# EAGLE schematic AM6548 (EAGLE 9.4.2), part 3 of 4
## Sheet 8 of 19: Debugging
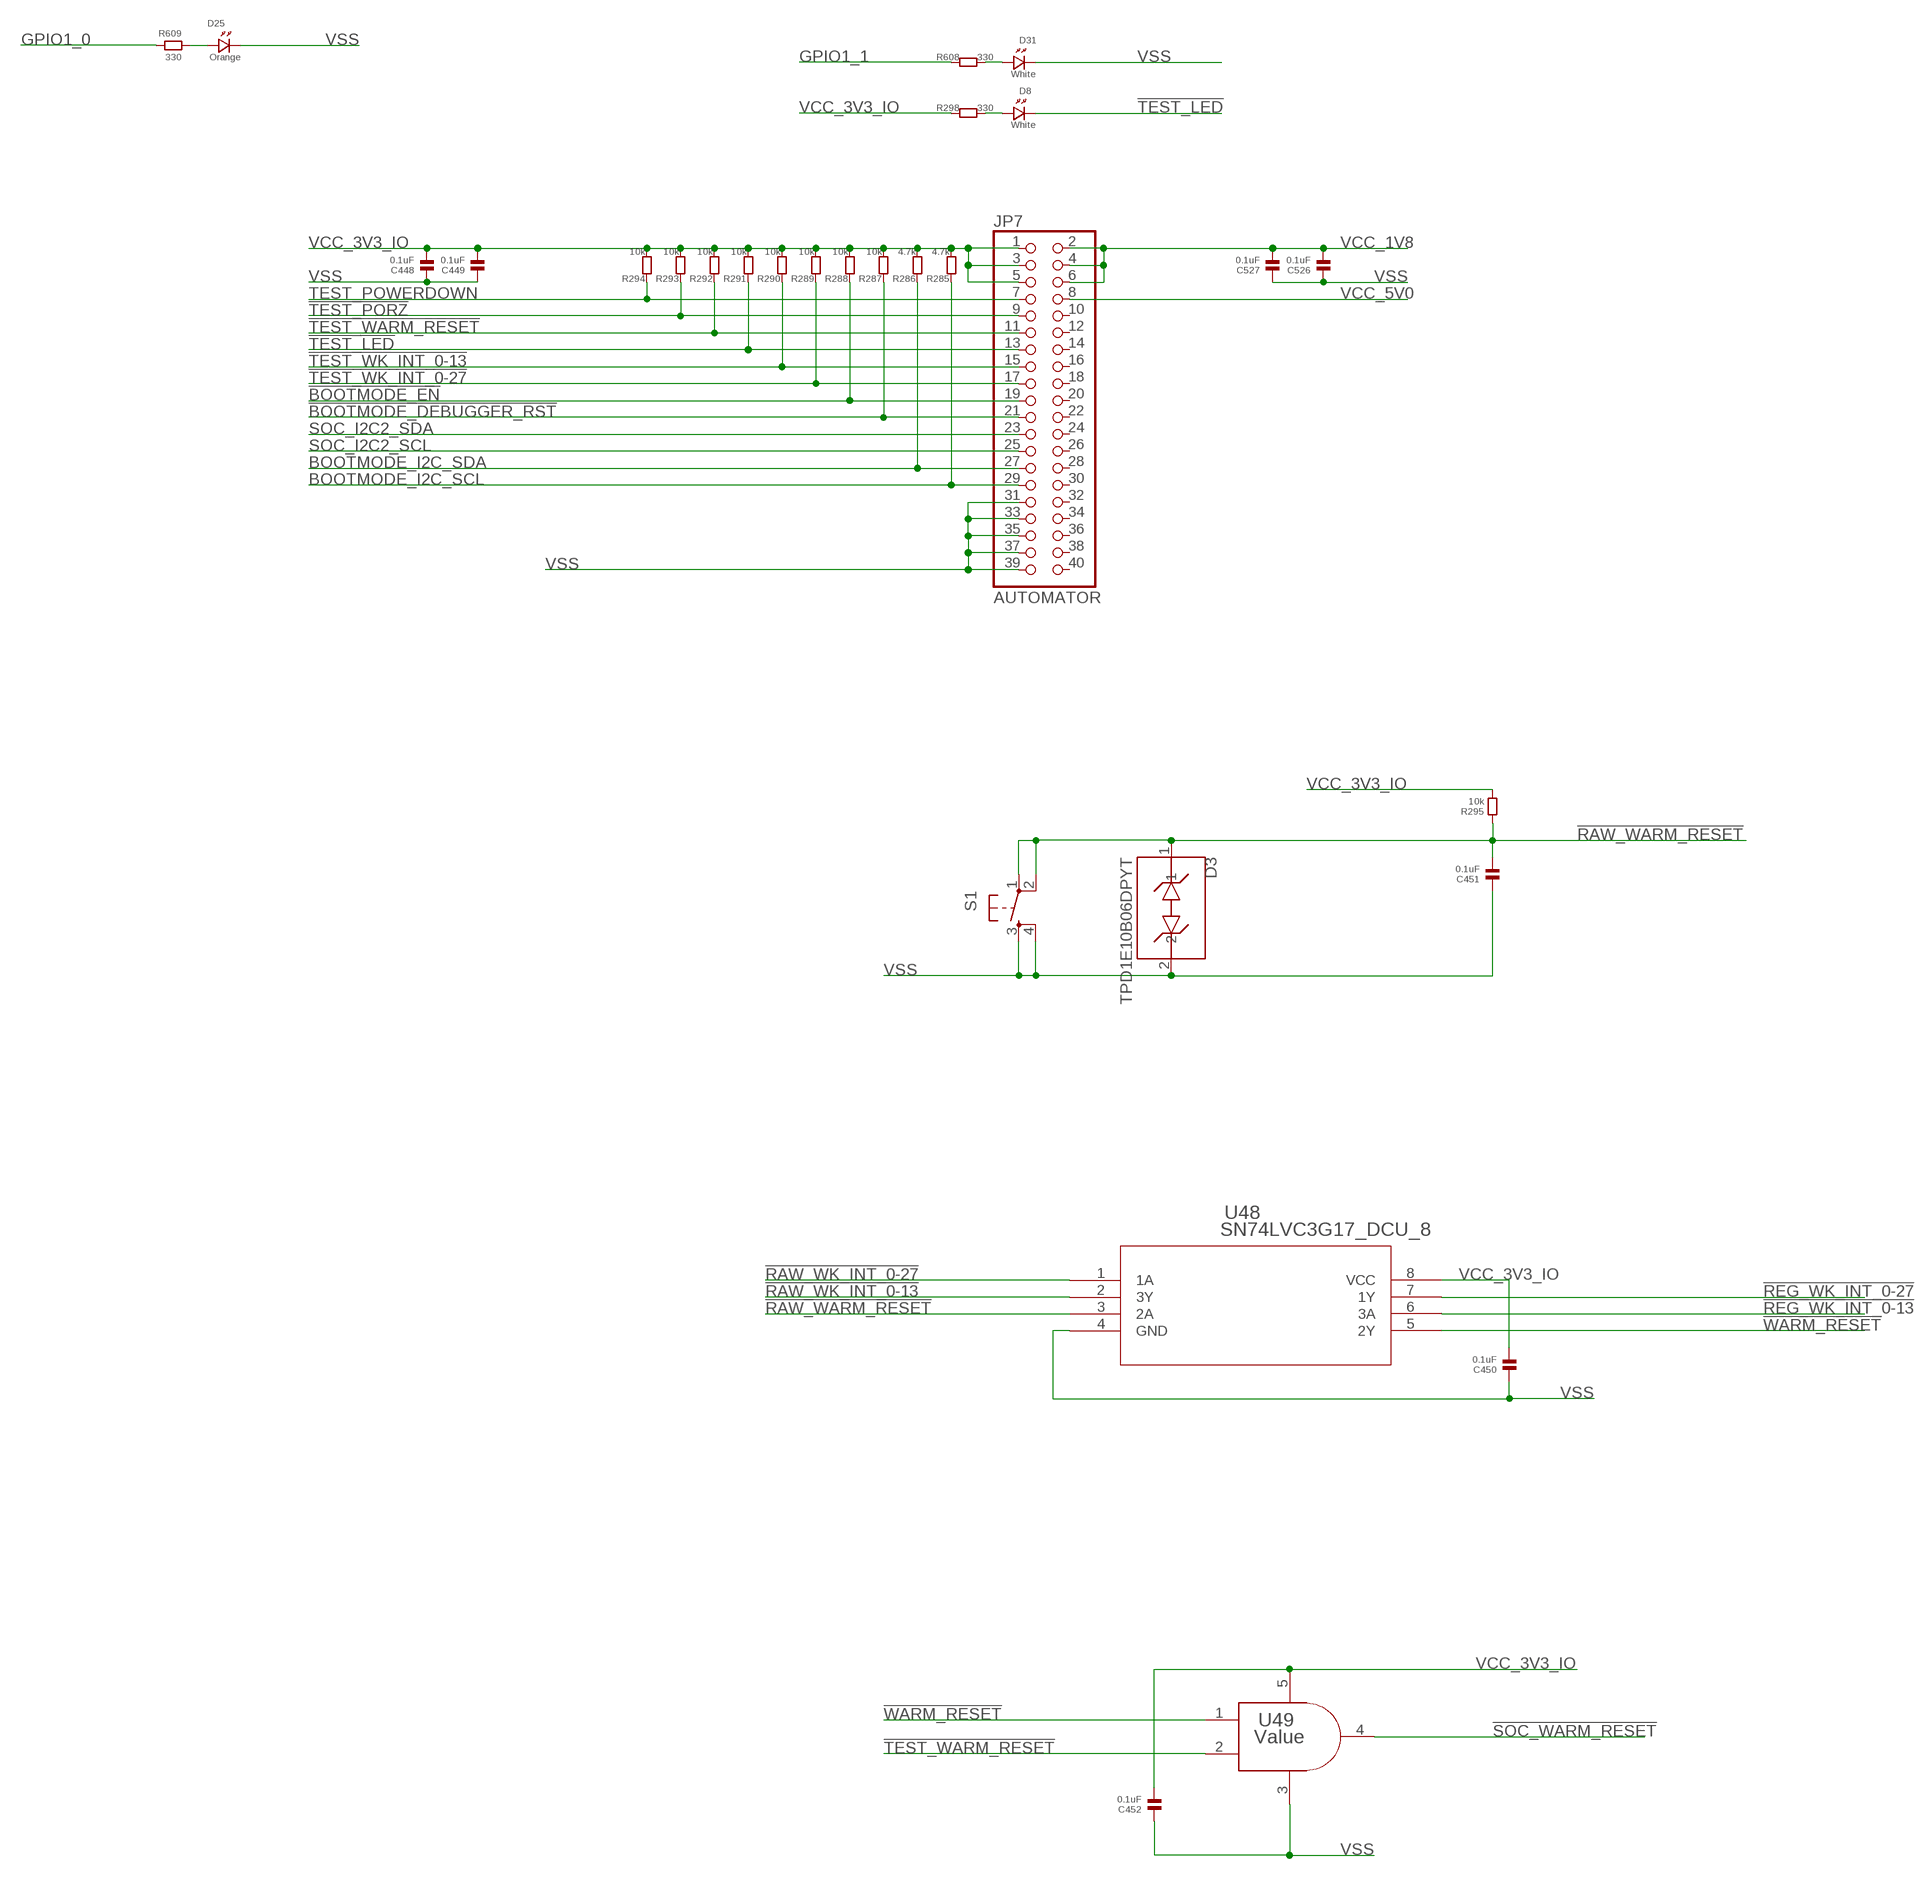
[diagram p16: schematic, sheet 8, part 1 of 2]
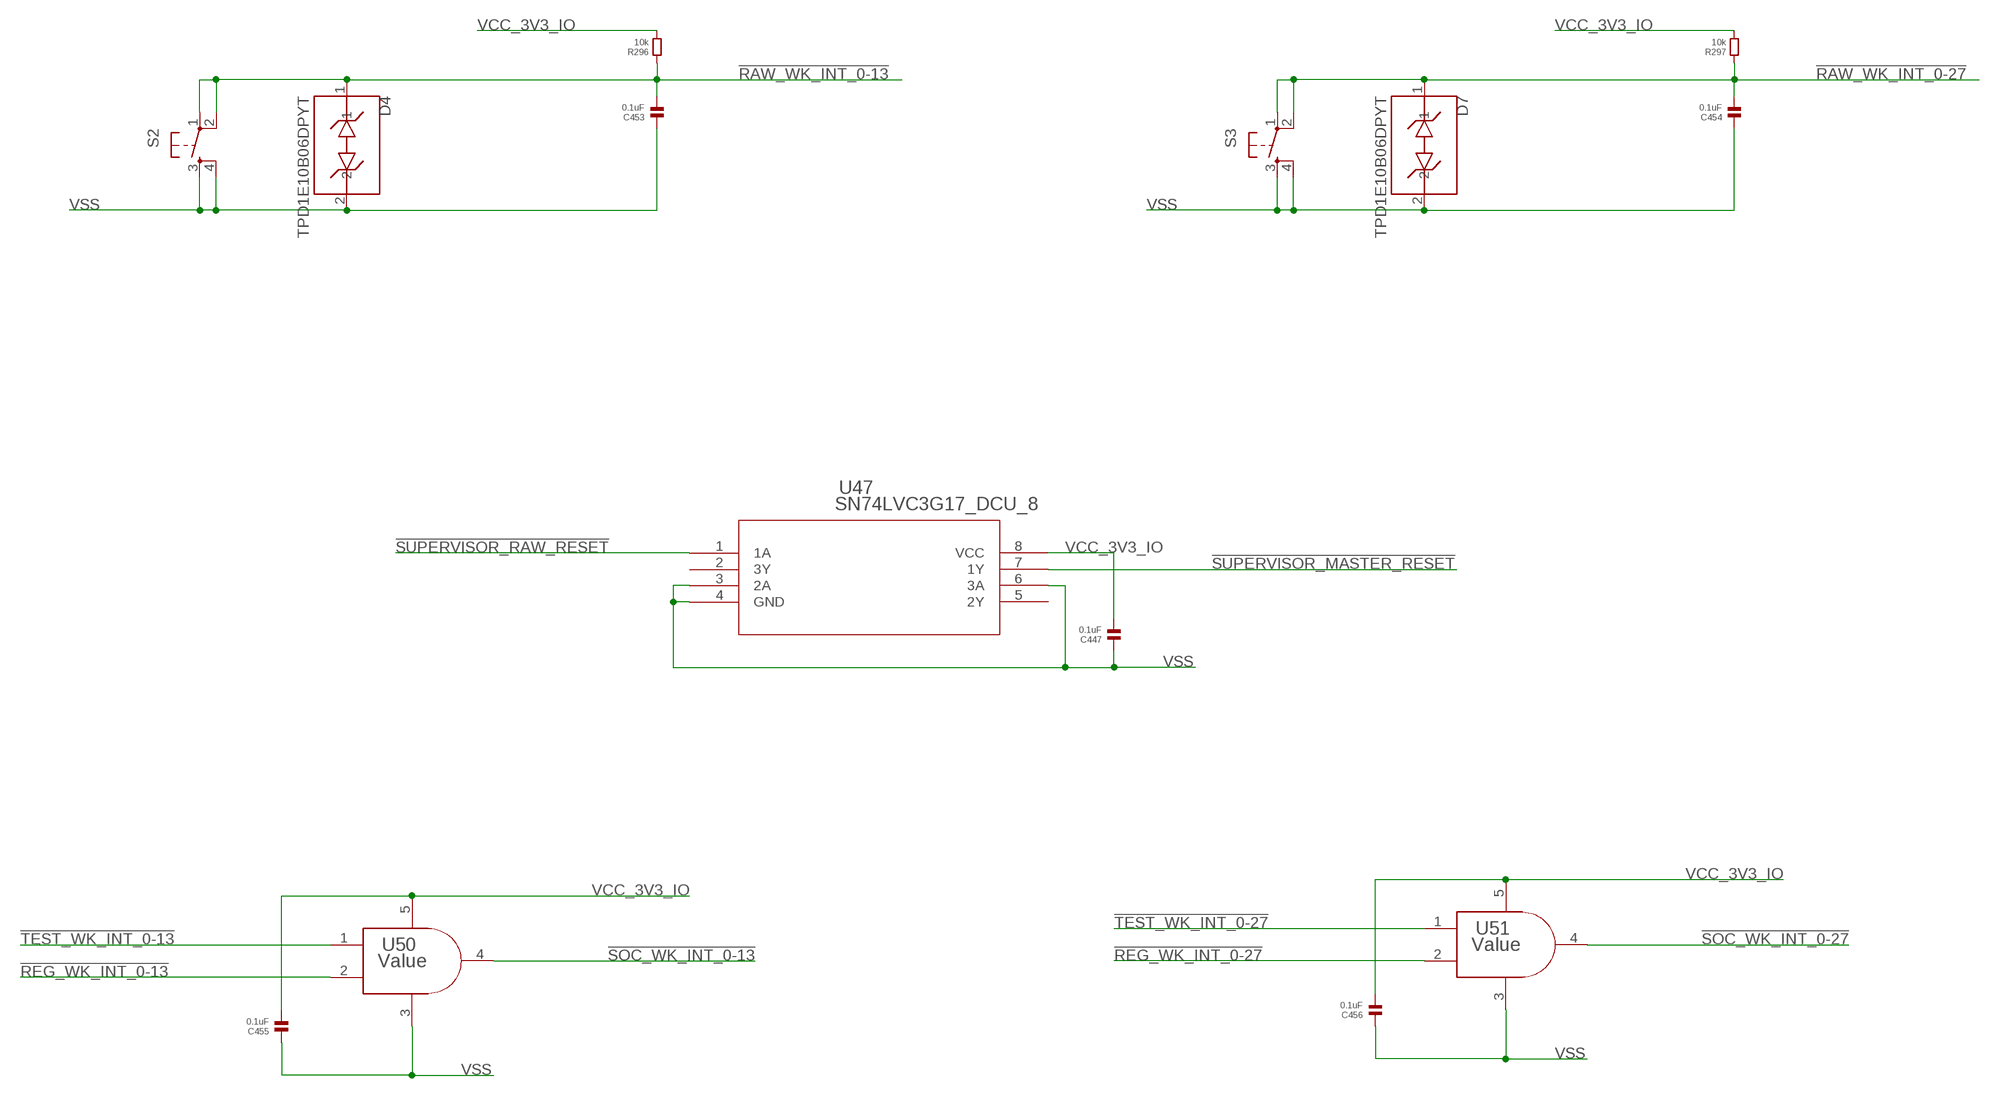
[diagram p17: schematic, sheet 8, part 2 of 2]

### Parts
C447  0.1uF  CAPACITOR.0603  [0603]
C448  0.1uF  CAPACITOR.0603  [0603]
C449  0.1uF  CAPACITOR.0603  [0603]
C450  0.1uF  CAPACITOR.0603  [0603]
C451  0.1uF  CAPACITOR.0603  [0603]
C452  0.1uF  CAPACITOR.0603  [0603]
C453  0.1uF  CAPACITOR.0603  [0603]
C454  0.1uF  CAPACITOR.0603  [0603]
C455  0.1uF  CAPACITOR.0603  [0603]
C456  0.1uF  CAPACITOR.0603  [0603]
C526  0.1uF  CAPACITOR.0603  [0603]
C527  0.1uF  CAPACITOR.0603  [0603]
D3  TPD1E10B06DPYT  [DFN100X60X45-2N]
D4  TPD1E10B06DPYT  [DFN100X60X45-2N]
D7  TPD1E10B06DPYT  [DFN100X60X45-2N]
D8  White  LED.0603  [0603.LED]
D25  Orange  LED.0603  [0603.LED]
D31  White  LED.0603  [0603.LED]
JP7  AUTOMATOR  PINHD-2X20  [2X20]
R285  4.7k  RESISTOR.0603  [0603]
R286  4.7k  RESISTOR.0603  [0603]
R287  10k  RESISTOR.0603  [0603]
R288  10k  RESISTOR.0603  [0603]
R289  10k  RESISTOR.0603  [0603]
R290  10k  RESISTOR.0603  [0603]
R291  10k  RESISTOR.0603  [0603]
R292  10k  RESISTOR.0603  [0603]
R293  10k  RESISTOR.0603  [0603]
R294  10k  RESISTOR.0603  [0603]
R295  10k  RESISTOR.0603  [0603]
R296  10k  RESISTOR.0603  [0603]
R297  10k  RESISTOR.0603  [0603]
R298  330  RESISTOR.0603  [0603]
R608  330  RESISTOR.0603  [0603]
R609  330  RESISTOR.0603  [0603]
S1  TAC_SWITCHPTH  [TACTILE-PTH]
S2  TAC_SWITCHPTH  [TACTILE-PTH]
S3  TAC_SWITCHPTH  [TACTILE-PTH]
U47  SN74LVC3G17_DCU_8  [DCU8]
U48  SN74LVC3G17_DCU_8  [DCU8]
U49  Value  SN74LVC1G08DBVR  [DBV0005A_N]
U50  Value  SN74LVC1G08DBVR  [DBV0005A_N]
U51  Value  SN74LVC1G08DBVR  [DBV0005A_N]

### Nets
!BOOTMODE_DEBUGGER_RST: JP7.21 R287.1 ; also sheet 11,17
!BOOTMODE_EN: JP7.19 R288.1 ; also sheet 11,17
!RAW_WARM_RESET: C451.2 D3.1 R295.1 S1.1 S1.2 U48.3(2A)
!RAW_WK_INT_0-13: C453.2 D4.1 R296.1 S2.1 S2.2 U48.2(3Y)
!RAW_WK_INT_0-27: C454.2 D7.1 R297.1 S3.1 S3.2 U48.1(1A)
!REG_WK_INT_0-13: U48.6(3A) U50.2(B)
!REG_WK_INT_0-27: U48.7(1Y) U51.2(B)
!SOC_WARM_RESET: U49.4(Y) ; also sheet 1
!SOC_WK_INT_0-13: U50.4(Y) ; also sheet 1
!SOC_WK_INT_0-27: U51.4(Y) ; also sheet 1
!SUPERVISOR_MASTER_RESET: U47.7(1Y) ; also sheet 5
!SUPERVISOR_RAW_RESET: U47.1(1A) ; also sheet 5
!TEST_LED: D8.P$2 JP7.13 R291.1
!TEST_PORZ: JP7.9 R293.1 ; also sheet 5
!TEST_WARM_RESET: JP7.11 R292.1 U49.2(B)
!TEST_WK_INT_0-13: JP7.15 R290.1 U50.1(A)
!TEST_WK_INT_0-27: JP7.17 R289.1 U51.1(A)
!WARM_RESET: U48.5(2Y) U49.1(A)
BOOTMODE_I2C_SCL: JP7.29 R285.1 ; also sheet 11
BOOTMODE_I2C_SDA: JP7.27 R286.1 ; also sheet 11
GPIO1_0: R609.1 ; also sheet 1,19
GPIO1_1: R608.1 ; also sheet 1,19
N$69: D25.P$1 R609.2
N$157: D8.P$1 R298.2
N$416: D31.P$1 R608.2
SOC_I2C2_SCL: JP7.25 ; also sheet 10,12,15,19
SOC_I2C2_SDA: JP7.23 ; also sheet 10,12,15,19
TEST_POWERDOWN: JP7.7 R294.1 ; also sheet 4
VCC_1V8: C526.2 C527.2 JP7.2 JP7.4 JP7.6 ; also sheet 1,3,6,7,10,13,14,15,18,19
VCC_3V3_IO: C447.2 C448.2 C449.2 C450.2 C452.2 C455.2 C456.2 JP7.1 JP7.3 JP7.5 R285.2 R286.2 R287.2 R288.2 R289.2 R290.2 R291.2 R292.2 R293.2 R294.2 R295.2 R296.2 R297.2 R298.1 U47.8(VCC) U48.8(VCC) U49.5(V+) U50.5(V+) U51.5(V+) ; also sheet 1,3,5,6,7,9,10,11,13,14,15,16,17,19
VCC_5V0: JP7.8 ; also sheet 3,7,9,16,19
VSS: C447.1 C448.1 C449.1 C450.1 C451.1 C452.1 C453.1 C454.1 C455.1 C456.1 C526.1 C527.1 D3.2 D4.2 D7.2 D25.P$2 D31.P$2 JP7.31 JP7.33 JP7.35 JP7.37 JP7.39 S1.3 S1.4 S2.3 S2.4 S3.3 S3.4 U47.3(2A) U47.4(GND) U47.6(3A) U48.4(GND) U49.3(V-) U50.3(V-) U51.3(V-) ; also sheet 1,2,3,4,5,6,7,9,10,11,12,13,14,15,16,17,18,19
Unconnected: JP7.10 JP7.12 JP7.14 JP7.16 JP7.18 JP7.20 JP7.22 JP7.24 JP7.26 JP7.28 JP7.30 JP7.32 JP7.34 JP7.36 JP7.38 JP7.40 U47.2(3Y) U47.5(2Y)

## Sheet 9 of 19: USB Interface
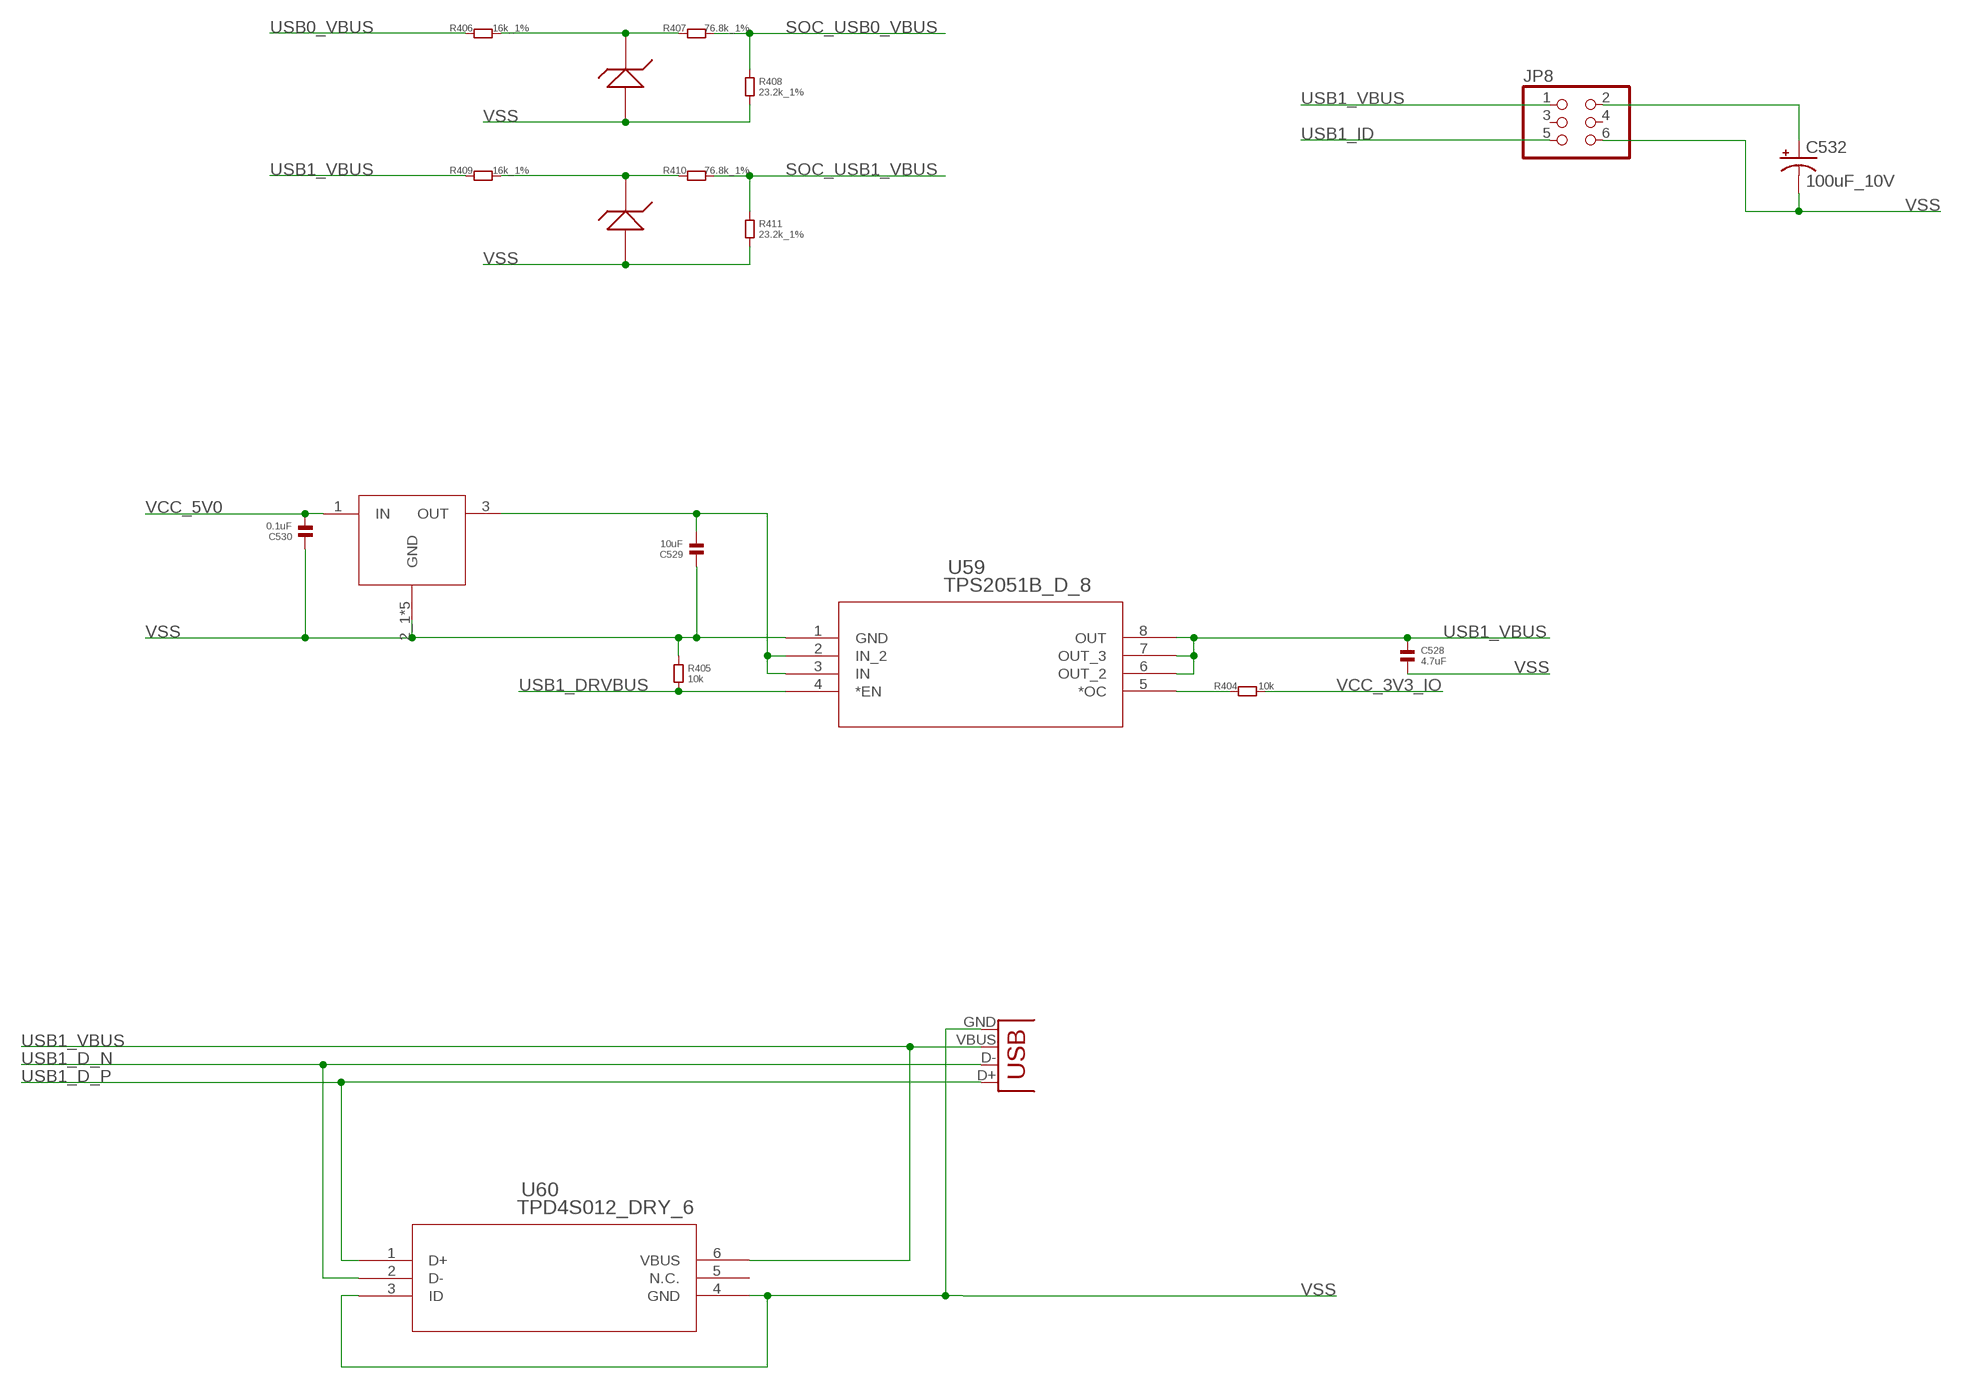
[diagram p18: schematic, sheet 9]

### Parts
C528  4.7uF  CAPACITOR.0603  [0603]
C529  10uF  CAPACITOR.0603  [0603]
C530  0.1uF  CAPACITOR.0603  [0603]
C532  100uF_10V  CPOL-USE2.5-5  [E2,5-5]
JP8  PINHD-2X3  [2X03]
R404  10k  RESISTOR.0603  [0603]
R405  10k  RESISTOR.0603  [0603]
R406  16k_1%  RESISTOR.0603  [0603]
R407  76.8k_1%  RESISTOR.0603  [0603]
R408  23.2k_1%  RESISTOR.0603  [0603]
R409  16k_1%  RESISTOR.0603  [0603]
R410  76.8k_1%  RESISTOR.0603  [0603]
R411  23.2k_1%  RESISTOR.0603  [0603]
U59  TPS2051B_D_8  [D8]
U60  TPD4S012_DRY_6  [DRY6]
U$18  NFM21PC  [FIL_NFM21PC105B1C3D]
U$19  BZX84C2V4LT1-D  [SOT-23]
U$36  BZX84C2V4LT1-D  [SOT-23]
X4  USB-A-H  [USB-A-H]

### Nets
N$294: C529.2 U59.2(IN_2) U59.3(IN) U$18.3(OUT)
N$295: R404.1 U59.5(*OC)
N$296: R406.2 R407.1 U$19.3(CATHODE)
N$297: R409.2 R410.1 U$36.3(CATHODE)
N$299: C532.+ JP8.2
SOC_USB0_VBUS: R407.2 R408.1 ; also sheet 1
SOC_USB1_VBUS [6mil]: R410.2 R411.1 ; also sheet 1
USB0_VBUS: R406.1 ; also sheet 19
USB1_D_N [6mil]: U60.2(D-) X4.D- ; also sheet 1
USB1_D_P [6mil]: U60.1(D+) X4.D+ ; also sheet 1
USB1_DRVBUS: R405.2 U59.4(*EN)
USB1_ID [6mil]: JP8.5 ; also sheet 1
USB1_VBUS: C528.1 JP8.1 R409.1 U59.6(OUT_2) U59.7(OUT_3) U59.8(OUT) U60.6(VBUS) X4.VBUS
VCC_3V3_IO: R404.2 ; also sheet 1,3,5,6,7,8,10,11,13,14,15,16,17,19
VCC_5V0: C530.2 U$18.1(IN) ; also sheet 3,7,8,16,19
VSS: C528.2 C529.1 C530.1 C532.- JP8.6 R405.1 R408.2 R411.2 U59.1(GND) U60.3(ID) U60.4(GND) U$18.2_1(GND) U$18.2_2(GND) U$18.S1(GND) U$18.S2(GND) U$18.S3(GND) U$19.1(ANODE) U$36.1(ANODE) X4.GND ; also sheet 1,2,3,4,5,6,7,8,10,11,12,13,14,15,16,17,18,19
Unconnected: JP8.3 JP8.4 U60.5(N.C.)

## Sheet 10 of 19: Current Monitoring
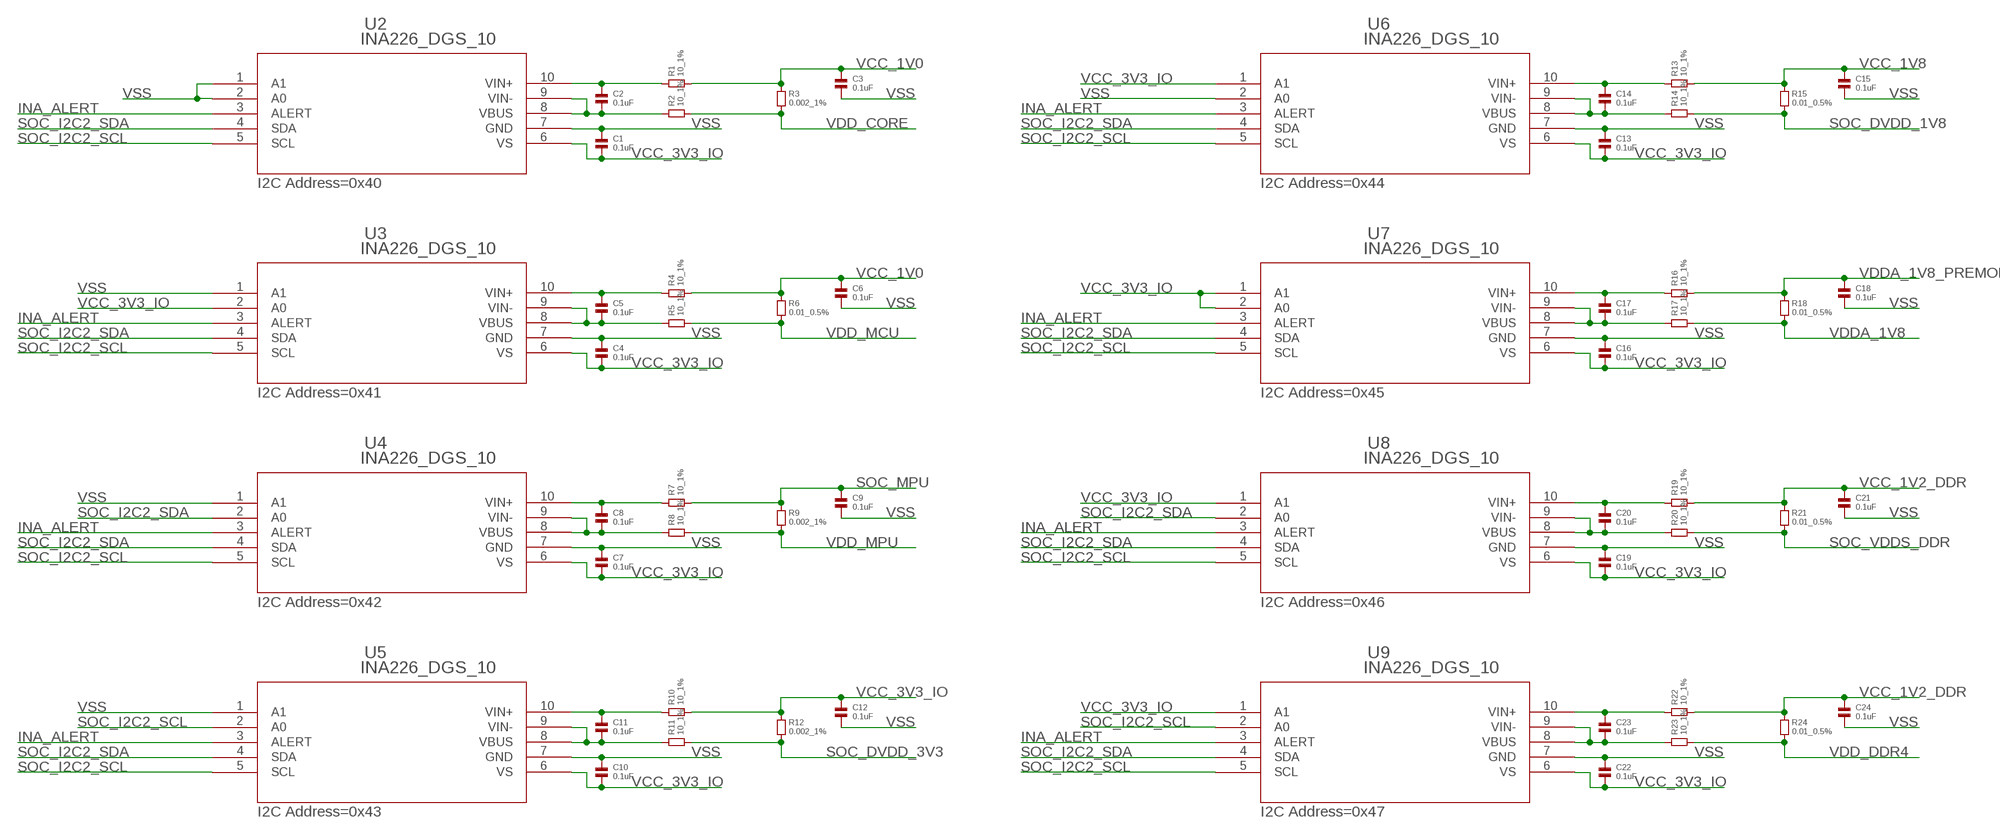
[diagram p19: schematic, sheet 10]

### Parts
C1  0.1uF  CAPACITOR.0603  [0603]
C2  0.1uF  CAPACITOR.0603  [0603]
C3  0.1uF  CAPACITOR.0603  [0603]
C4  0.1uF  CAPACITOR.0603  [0603]
C5  0.1uF  CAPACITOR.0603  [0603]
C6  0.1uF  CAPACITOR.0603  [0603]
C7  0.1uF  CAPACITOR.0603  [0603]
C8  0.1uF  CAPACITOR.0603  [0603]
C9  0.1uF  CAPACITOR.0603  [0603]
C10  0.1uF  CAPACITOR.0603  [0603]
C11  0.1uF  CAPACITOR.0603  [0603]
C12  0.1uF  CAPACITOR.0603  [0603]
C13  0.1uF  CAPACITOR.0603  [0603]
C14  0.1uF  CAPACITOR.0603  [0603]
C15  0.1uF  CAPACITOR.0603  [0603]
C16  0.1uF  CAPACITOR.0603  [0603]
C17  0.1uF  CAPACITOR.0603  [0603]
C18  0.1uF  CAPACITOR.0603  [0603]
C19  0.1uF  CAPACITOR.0603  [0603]
C20  0.1uF  CAPACITOR.0603  [0603]
C21  0.1uF  CAPACITOR.0603  [0603]
C22  0.1uF  CAPACITOR.0603  [0603]
C23  0.1uF  CAPACITOR.0603  [0603]
C24  0.1uF  CAPACITOR.0603  [0603]
R1  10_1%  RESISTOR.0603  [0603]
R2  10_1%  RESISTOR.0603  [0603]
R3  0.002_1%  RESISTOR.1206  [1206]
R4  10_1%  RESISTOR.0603  [0603]
R5  10_1%  RESISTOR.0603  [0603]
R6  0.01_0.5%  RESISTOR.1206  [1206]
R7  10_1%  RESISTOR.0603  [0603]
R8  10_1%  RESISTOR.0603  [0603]
R9  0.002_1%  RESISTOR.1206  [1206]
R10  10_1%  RESISTOR.0603  [0603]
R11  10_1%  RESISTOR.0603  [0603]
R12  0.002_1%  RESISTOR.1206  [1206]
R13  10_1%  RESISTOR.0603  [0603]
R14  10_1%  RESISTOR.0603  [0603]
R15  0.01_0.5%  RESISTOR.1206  [1206]
R16  10_1%  RESISTOR.0603  [0603]
R17  10_1%  RESISTOR.0603  [0603]
R18  0.01_0.5%  RESISTOR.1206  [1206]
R19  10_1%  RESISTOR.0603  [0603]
R20  10_1%  RESISTOR.0603  [0603]
R21  0.01_0.5%  RESISTOR.1206  [1206]
R22  10_1%  RESISTOR.0603  [0603]
R23  10_1%  RESISTOR.0603  [0603]
R24  0.01_0.5%  RESISTOR.1206  [1206]
U2  INA226_DGS_10  [DGS10]
U3  INA226_DGS_10  [DGS10]
U4  INA226_DGS_10  [DGS10]
U5  INA226_DGS_10  [DGS10]
U6  INA226_DGS_10  [DGS10]
U7  INA226_DGS_10  [DGS10]
U8  INA226_DGS_10  [DGS10]
U9  INA226_DGS_10  [DGS10]

### Nets
INA_ALERT: U2.3(ALERT) U3.3(ALERT) U4.3(ALERT) U5.3(ALERT) U6.3(ALERT) U7.3(ALERT) U8.3(ALERT) U9.3(ALERT) ; also sheet 17
N$1: C2.2 R2.1 U2.8(VBUS) U2.9(VIN-)
N$2: C2.1 R1.1 U2.10(VIN+)
N$3: C5.2 R5.1 U3.8(VBUS) U3.9(VIN-)
N$4: C5.1 R4.1 U3.10(VIN+)
N$5: C8.2 R8.1 U4.8(VBUS) U4.9(VIN-)
N$6: C8.1 R7.1 U4.10(VIN+)
N$7: C11.2 R11.1 U5.8(VBUS) U5.9(VIN-)
N$8: C11.1 R10.1 U5.10(VIN+)
N$9: C14.2 R14.1 U6.8(VBUS) U6.9(VIN-)
N$10: C14.1 R13.1 U6.10(VIN+)
N$11: C17.2 R17.1 U7.8(VBUS) U7.9(VIN-)
N$12: C17.1 R16.1 U7.10(VIN+)
N$13: C20.2 R20.1 U8.8(VBUS) U8.9(VIN-)
N$14: C20.1 R19.1 U8.10(VIN+)
N$15: C23.2 R23.1 U9.8(VBUS) U9.9(VIN-)
N$16: C23.1 R22.1 U9.10(VIN+)
SOC_DVDD_1V8: R14.2 R15.2 ; also sheet 2
SOC_DVDD_3V3: R11.2 R12.2 ; also sheet 1,2
SOC_I2C2_SCL: U2.5(SCL) U3.5(SCL) U4.5(SCL) U5.2(A0) U5.5(SCL) U6.5(SCL) U7.5(SCL) U8.5(SCL) U9.2(A0) U9.5(SCL) ; also sheet 8,12,15,19
SOC_I2C2_SDA: U2.4(SDA) U3.4(SDA) U4.2(A0) U4.4(SDA) U5.4(SDA) U6.4(SDA) U7.4(SDA) U8.2(A0) U8.4(SDA) U9.4(SDA) ; also sheet 8,12,15,19
SOC_MPU: C9.1 R7.2 R9.1 ; also sheet 3
SOC_VDDS_DDR: R20.2 R21.2 ; also sheet 2
VCC_1V0: C3.1 C6.1 R1.2 R3.1 R4.2 R6.1 ; also sheet 3
VCC_1V2_DDR: C21.1 C24.1 R19.2 R21.1 R22.2 R24.1 ; also sheet 3
VCC_1V8: C15.1 R13.2 R15.1 ; also sheet 1,3,6,7,8,13,14,15,18,19
VCC_3V3_IO: C1.2 C4.2 C7.2 C10.2 C12.1 C13.2 C16.2 C19.2 C22.2 R10.2 R12.1 U2.6(VS) U3.2(A0) U3.6(VS) U4.6(VS) U5.6(VS) U6.1(A1) U6.6(VS) U7.1(A1) U7.2(A0) U7.6(VS) U8.1(A1) U8.6(VS) U9.1(A1) U9.6(VS) ; also sheet 1,3,5,6,7,8,9,11,13,14,15,16,17,19
VDD_CORE: R2.2 R3.2 ; also sheet 2,3
VDD_DDR4: R23.2 R24.2 ; also sheet 3,12
VDD_MCU: R5.2 R6.2 ; also sheet 2
VDD_MPU: R8.2 R9.2 ; also sheet 2,3,5
VDDA_1V8: R17.2 R18.2 ; also sheet 2
VDDA_1V8_PREMON: C18.1 R16.2 R18.1 ; also sheet 3
VSS: C1.1 C3.2 C4.1 C6.2 C7.1 C9.2 C10.1 C12.2 C13.1 C15.2 C16.1 C18.2 C19.1 C21.2 C22.1 C24.2 U2.1(A1) U2.2(A0) U2.7(GND) U3.1(A1) U3.7(GND) U4.1(A1) U4.7(GND) U5.1(A1) U5.7(GND) U6.2(A0) U6.7(GND) U7.7(GND) U8.7(GND) U9.7(GND) ; also sheet 1,2,3,4,5,6,7,8,9,11,12,13,14,15,16,17,18,19

### Notes on the sheet
- I2C Address=0x40 | I2C Address=0x44
- I2C Address=0x41 | I2C Address=0x45
- I2C Address=0x42 | I2C Address=0x46
- I2C Address=0x43 | I2C Address=0x47

## Sheet 11 of 19: Bootmode
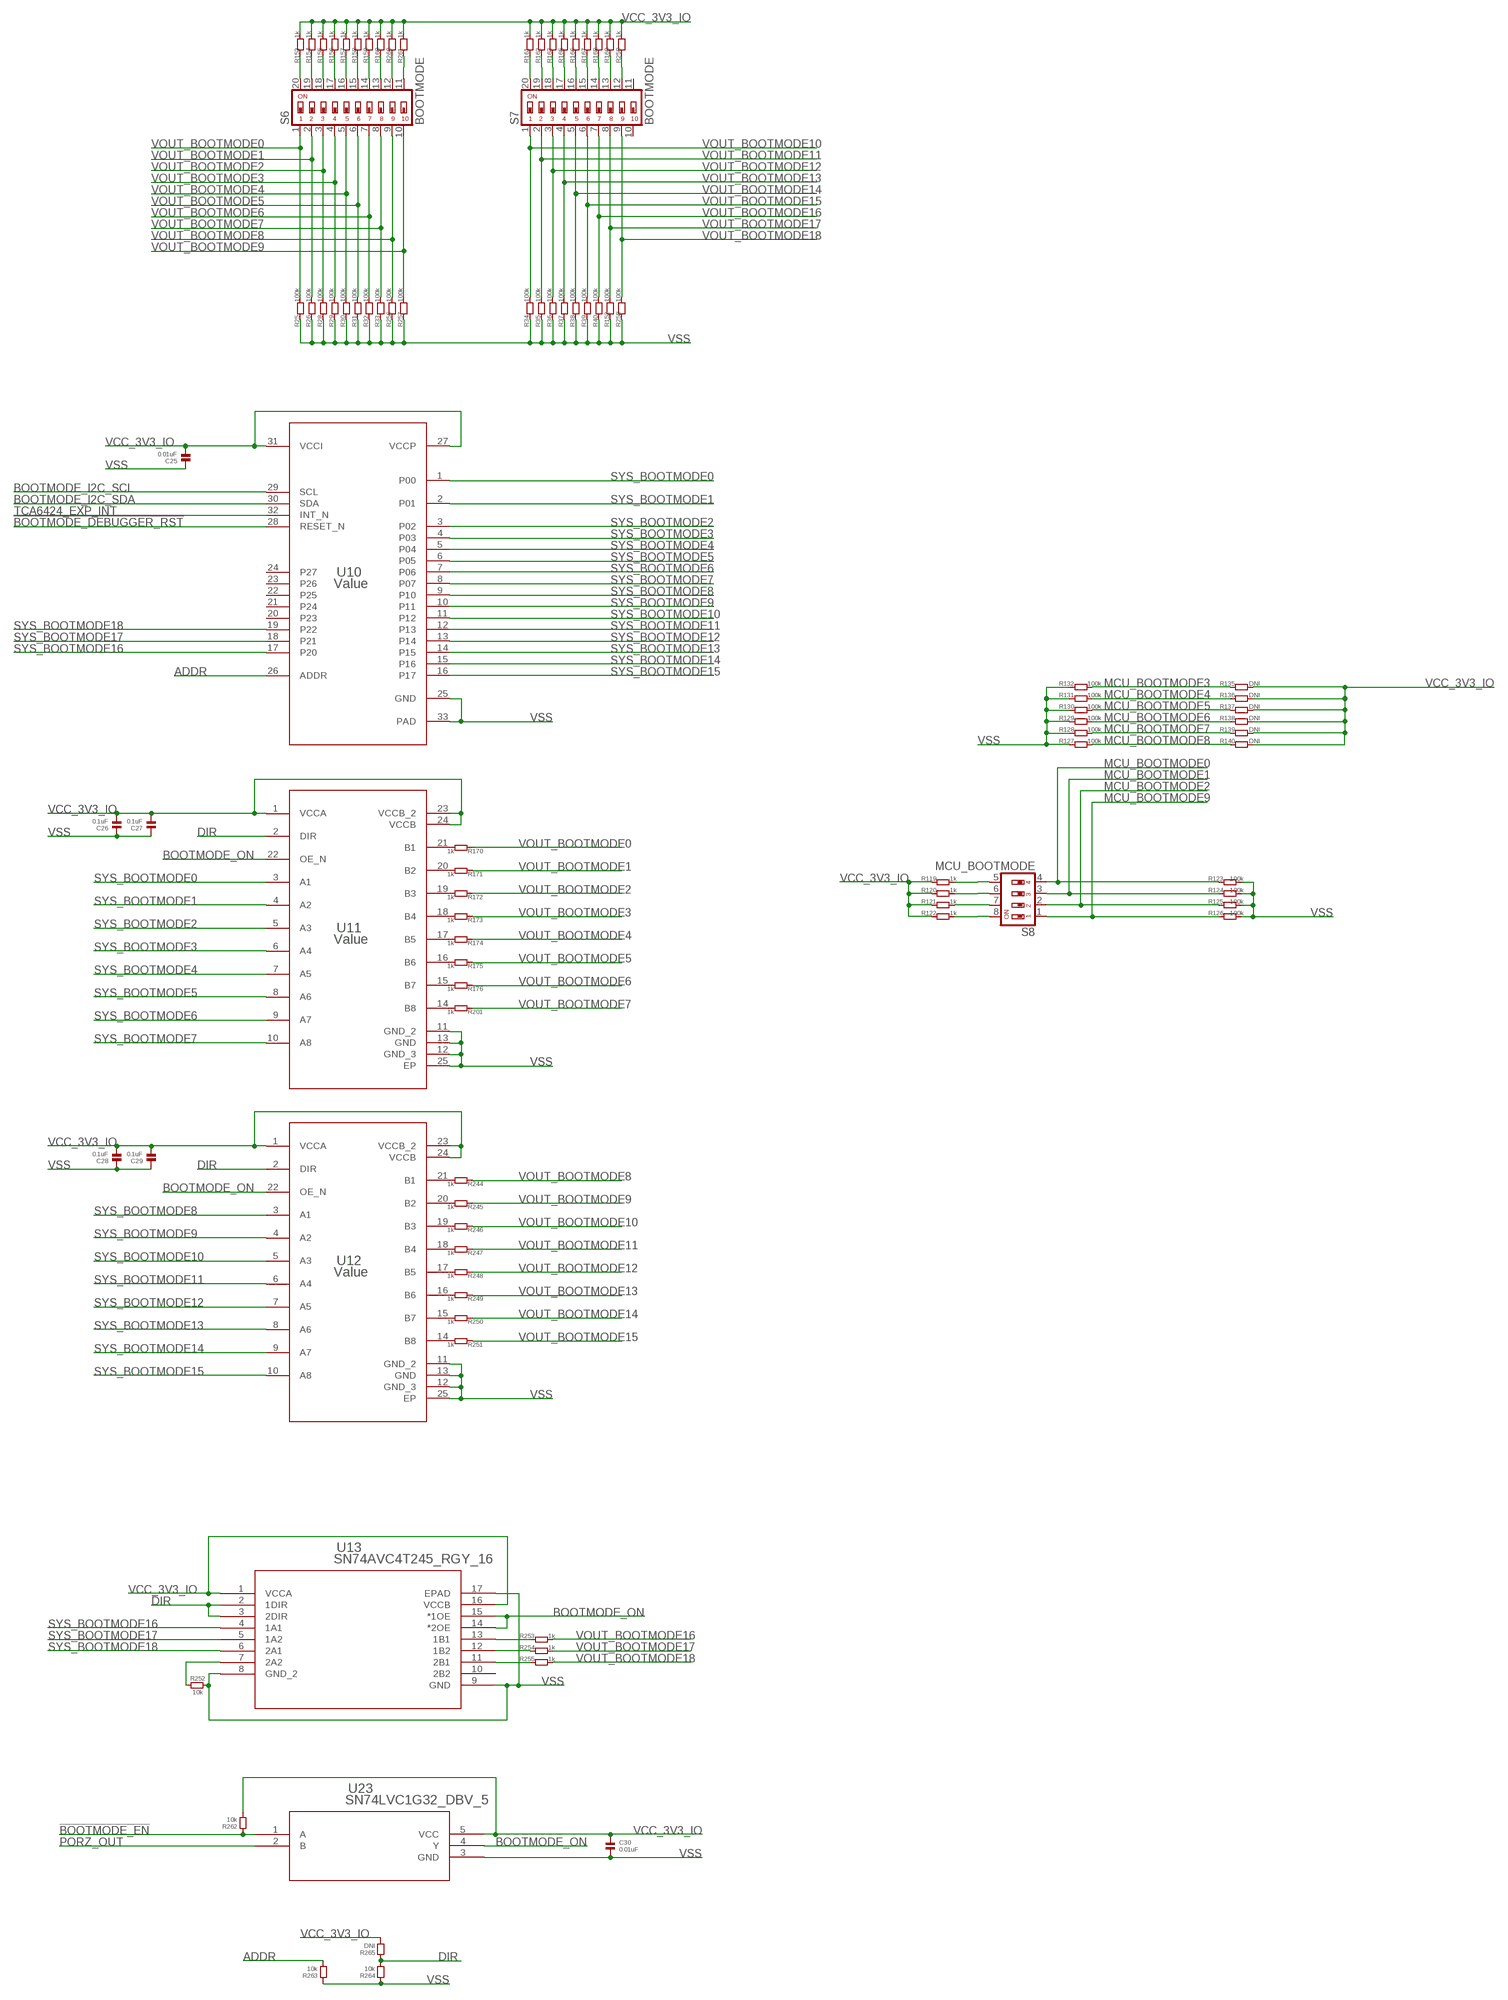
[diagram p20: schematic, sheet 11]

### Parts
C25  0.01uF  CAPACITOR.0603  [0603]
C26  0.1uF  CAPACITOR.0603  [0603]
C27  0.1uF  CAPACITOR.0603  [0603]
C28  0.1uF  CAPACITOR.0603  [0603]
C29  0.1uF  CAPACITOR.0603  [0603]
C30  0.01uF  CAPACITOR.0603  [0603]
R25  100k  RESISTOR.0603  [0603]
R26  100k  RESISTOR.0603  [0603]
R28  100k  RESISTOR.0603  [0603]
R29  100k  RESISTOR.0603  [0603]
R30  100k  RESISTOR.0603  [0603]
R31  100k  RESISTOR.0603  [0603]
R32  100k  RESISTOR.0603  [0603]
R33  100k  RESISTOR.0603  [0603]
R34  100k  RESISTOR.0603  [0603]
R35  100k  RESISTOR.0603  [0603]
R36  100k  RESISTOR.0603  [0603]
R37  100k  RESISTOR.0603  [0603]
R38  100k  RESISTOR.0603  [0603]
R39  100k  RESISTOR.0603  [0603]
R40  100k  RESISTOR.0603  [0603]
R119  1k  RESISTOR.0603  [0603]
R120  1k  RESISTOR.0603  [0603]
R121  1k  RESISTOR.0603  [0603]
R122  1k  RESISTOR.0603  [0603]
R123  100k  RESISTOR.0603  [0603]
R124  100k  RESISTOR.0603  [0603]
R125  100k  RESISTOR.0603  [0603]
R126  100k  RESISTOR.0603  [0603]
R127  100k  RESISTOR.0402  [0402]
R128  100k  RESISTOR.0402  [0402]
R129  100k  RESISTOR.0402  [0402]
R130  100k  RESISTOR.0402  [0402]
R131  100k  RESISTOR.0402  [0402]
R132  100k  RESISTOR.0402  [0402]
R135  DNI  RESISTOR.0402  [0402]
R136  DNI  RESISTOR.0402  [0402]
R137  DNI  RESISTOR.0402  [0402]
R138  DNI  RESISTOR.0402  [0402]
R139  DNI  RESISTOR.0402  [0402]
R140  DNI  RESISTOR.0402  [0402]
R152  100k  RESISTOR.0603  [0603]
R153  1k  RESISTOR.0603  [0603]
R154  1k  RESISTOR.0603  [0603]
R155  1k  RESISTOR.0603  [0603]
R156  1k  RESISTOR.0603  [0603]
R157  1k  RESISTOR.0603  [0603]
R158  1k  RESISTOR.0603  [0603]
R159  1k  RESISTOR.0603  [0603]
R160  1k  RESISTOR.0603  [0603]
R161  1k  RESISTOR.0603  [0603]
R162  1k  RESISTOR.0603  [0603]
R163  1k  RESISTOR.0603  [0603]
R165  1k  RESISTOR.0603  [0603]
R166  1k  RESISTOR.0603  [0603]
R167  1k  RESISTOR.0603  [0603]
R168  1k  RESISTOR.0603  [0603]
R169  1k  RESISTOR.0603  [0603]
R170  1k  RESISTOR.0402  [0402]
R171  1k  RESISTOR.0402  [0402]
R172  1k  RESISTOR.0402  [0402]
R173  1k  RESISTOR.0402  [0402]
R174  1k  RESISTOR.0402  [0402]
R175  1k  RESISTOR.0402  [0402]
R176  1k  RESISTOR.0402  [0402]
R201  1k  RESISTOR.0402  [0402]
R244  1k  RESISTOR.0402  [0402]
R245  1k  RESISTOR.0402  [0402]
R246  1k  RESISTOR.0402  [0402]
R247  1k  RESISTOR.0402  [0402]
R248  1k  RESISTOR.0402  [0402]
R249  1k  RESISTOR.0402  [0402]
R250  1k  RESISTOR.0402  [0402]
R251  1k  RESISTOR.0402  [0402]
R252  10k  RESISTOR.0603  [0603]
R253  1k  RESISTOR.0402  [0402]
R254  1k  RESISTOR.0402  [0402]
R255  1k  RESISTOR.0402  [0402]
R256  100k  RESISTOR.0603  [0603]
R257  100k  RESISTOR.0603  [0603]
R258  100k  RESISTOR.0603  [0603]
R259  1k  RESISTOR.0603  [0603]
R260  1k  RESISTOR.0603  [0603]
R261  1k  RESISTOR.0603  [0603]
R262  10k  RESISTOR.0603  [0603]
R263  10k  RESISTOR.0603  [0603]
R264  10k  RESISTOR.0603  [0603]
R265  DNI  RESISTOR.0603  [0603]
S6  BOOTMODE  SWS010  [SMS-010]
S7  BOOTMODE  SWS010  [SMS-010]
S8  MCU_BOOTMODE  SWS004  [SMS-004]
U10  Value  TCA6424ARGJR  [RGJ0032A]
U11  Value  SN74AVC8T245RHLR  [RHL0024A]
U12  Value  SN74AVC8T245RHLR  [RHL0024A]
U13  SN74AVC4T245_RGY_16  [RGY16_2P55X2P05]
U23  SN74LVC1G32_DBV_5  [DBV5]

### Nets
!BOOTMODE_DEBUGGER_RST: U10.28(RESET_N) ; also sheet 8,17
!BOOTMODE_EN: R262.1 U23.1(A) ; also sheet 8,17
ADDR: R263.2 U10.26(ADDR)
BOOTMODE_I2C_SCL: U10.29(SCL) ; also sheet 8
BOOTMODE_I2C_SDA: U10.30(SDA) ; also sheet 8
BOOTMODE_ON: U11.22(OE_N) U12.22(OE_N) U13.14(*2OE) U13.15(*1OE) U23.4(Y)
DIR: R264.2 R265.1 U11.2(DIR) U12.2(DIR) U13.2(1DIR) U13.3(2DIR)
MCU_BOOTMODE0: R123.1 S8.4 ; also sheet 1,6
MCU_BOOTMODE1: R124.1 S8.3 ; also sheet 1,6
MCU_BOOTMODE2: R125.1 S8.2 ; also sheet 1
MCU_BOOTMODE3: R132.2 R135.1 ; also sheet 1
MCU_BOOTMODE4: R131.2 R136.1 ; also sheet 1
MCU_BOOTMODE5: R130.2 R137.1 ; also sheet 1
MCU_BOOTMODE6: R129.2 R138.1 ; also sheet 1
MCU_BOOTMODE7: R128.2 R139.1 ; also sheet 1
MCU_BOOTMODE8: R127.2 R140.1 ; also sheet 1
MCU_BOOTMODE9: R126.1 S8.1 ; also sheet 1
N$17: R161.1 S7.20
N$18: R162.1 S7.19
N$19: R163.1 S7.18
N$20: R165.1 S7.17
N$21: R166.1 S7.16
N$22: R167.1 S7.15
N$23: R168.1 S7.14
N$24: R169.1 S7.13
N$25: R160.1 S6.13
N$26: R159.1 S6.14
N$27: R158.1 S6.15
N$28: R157.1 S6.16
N$29: R156.1 S6.17
N$30: R155.1 S6.18
N$31: R154.1 S6.19
N$32: R153.1 S6.20
N$33: R170.2 U11.21(B1)
N$34: R171.2 U11.20(B2)
N$35: R172.2 U11.19(B3)
N$36: R173.2 U11.18(B4)
N$37: R174.2 U11.17(B5)
N$38: R175.2 U11.16(B6)
N$39: R176.2 U11.15(B7)
N$40: R201.2 U11.14(B8)
N$41: R244.2 U12.21(B1)
N$42: R245.2 U12.20(B2)
N$43: R246.2 U12.19(B3)
N$44: R247.2 U12.18(B4)
N$45: R248.2 U12.17(B5)
N$47: R249.2 U12.16(B6)
N$60: R250.2 U12.15(B7)
N$72: R251.2 U12.14(B8)
N$73: R252.2 U13.7(2A2)
N$74: R255.1 U13.11(2B1)
N$75: R254.1 U13.12(1B2)
N$76: R253.1 U13.13(1B1)
N$77: R261.1 S6.11
N$78: R260.1 S6.12
N$79: R259.1 S7.12
N$80: R119.2 S8.5
N$120: R122.2 S8.8
N$121: R121.2 S8.7
N$122: R120.2 S8.6
PORZ_OUT: U23.2(B) ; also sheet 1,6,13,16,17,18,19
SYS_BOOTMODE0: U10.1(P00) U11.3(A1)
SYS_BOOTMODE1: U10.2(P01) U11.4(A2)
SYS_BOOTMODE2: U10.3(P02) U11.5(A3)
SYS_BOOTMODE3: U10.4(P03) U11.6(A4)
SYS_BOOTMODE4: U10.5(P04) U11.7(A5)
SYS_BOOTMODE5: U10.6(P05) U11.8(A6)
SYS_BOOTMODE6: U10.7(P06) U11.9(A7)
SYS_BOOTMODE7: U10.8(P07) U11.10(A8)
SYS_BOOTMODE8: U10.9(P10) U12.3(A1)
SYS_BOOTMODE9: U10.10(P11) U12.4(A2)
SYS_BOOTMODE10: U10.11(P12) U12.5(A3)
SYS_BOOTMODE11: U10.12(P13) U12.6(A4)
SYS_BOOTMODE12: U10.13(P14) U12.7(A5)
SYS_BOOTMODE13: U10.14(P15) U12.8(A6)
SYS_BOOTMODE14: U10.15(P16) U12.9(A7)
SYS_BOOTMODE15: U10.16(P17) U12.10(A8)
SYS_BOOTMODE16: U10.17(P20) U13.4(1A1)
SYS_BOOTMODE17: U10.18(P21) U13.5(1A2)
SYS_BOOTMODE18: U10.19(P22) U13.6(2A1)
TCA6424_EXP_INT: U10.32(INT_N)
VCC_3V3_IO: C25.2 C26.2 C27.2 C28.2 C29.2 C30.1 R119.1 R120.1 R121.1 R122.1 R135.2 R136.2 R137.2 R138.2 R139.2 R140.2 R153.2 R154.2 R155.2 R156.2 R157.2 R158.2 R159.2 R160.2 R161.2 R162.2 R163.2 R165.2 R166.2 R167.2 R168.2 R169.2 R259.2 R260.2 R261.2 R262.2 R265.2 U10.27(VCCP) U10.31(VCCI) U11.1(VCCA) U11.23(VCCB_2) U11.24(VCCB) U12.1(VCCA) U12.23(VCCB_2) U12.24(VCCB) U13.1(VCCA) U13.16(VCCB) U23.5(VCC) ; also sheet 1,3,5,6,7,8,9,10,13,14,15,16,17,19
VOUT_BOOTMODE0: R25.2 R170.1 S6.1 ; also sheet 12
VOUT_BOOTMODE1: R26.2 R171.1 S6.2 ; also sheet 12
VOUT_BOOTMODE2: R28.2 R172.1 S6.3 ; also sheet 12
VOUT_BOOTMODE3: R29.2 R173.1 S6.4 ; also sheet 12
VOUT_BOOTMODE4: R30.2 R174.1 S6.5 ; also sheet 12
VOUT_BOOTMODE5: R31.2 R175.1 S6.6 ; also sheet 12
VOUT_BOOTMODE6: R32.2 R176.1 S6.7 ; also sheet 12
VOUT_BOOTMODE7: R33.2 R201.1 S6.8 ; also sheet 12
VOUT_BOOTMODE8: R244.1 R256.2 S6.9 ; also sheet 12
VOUT_BOOTMODE9: R245.1 R257.2 S6.10 ; also sheet 12
VOUT_BOOTMODE10: R34.2 R246.1 S7.1 ; also sheet 12
VOUT_BOOTMODE11: R35.2 R247.1 S7.2 ; also sheet 12
VOUT_BOOTMODE12: R36.2 R248.1 S7.3 ; also sheet 12
VOUT_BOOTMODE13: R37.2 R249.1 S7.4 ; also sheet 12
VOUT_BOOTMODE14: R38.2 R250.1 S7.5 ; also sheet 12
VOUT_BOOTMODE15: R39.2 R251.1 S7.6 ; also sheet 12
VOUT_BOOTMODE16: R40.2 R253.2 S7.7 ; also sheet 12
VOUT_BOOTMODE17: R152.2 R254.2 S7.8 ; also sheet 12
VOUT_BOOTMODE18: R255.2 R258.2 S7.9 ; also sheet 12
VSS: C25.1 C26.1 C27.1 C28.1 C29.1 C30.2 R25.1 R26.1 R28.1 R29.1 R30.1 R31.1 R32.1 R33.1 R34.1 R35.1 R36.1 R37.1 R38.1 R39.1 R40.1 R123.2 R124.2 R125.2 R126.2 R127.1 R128.1 R129.1 R130.1 R131.1 R132.1 R152.1 R252.1 R256.1 R257.1 R258.1 R263.1 R264.1 U10.25(GND) U10.33(PAD) U11.11(GND_2) U11.12(GND_3) U11.13(GND) U11.25(EP) U12.11(GND_2) U12.12(GND_3) U12.13(GND) U12.25(EP) U13.8(GND_2) U13.9(GND) U13.17(EPAD) U23.3(GND) ; also sheet 1,2,3,4,5,6,7,8,9,10,12,13,14,15,16,17,18,19
Unconnected: S7.10 S7.11 U10.20(P23) U10.21(P24) U10.22(P25) U10.23(P26) U10.24(P27) U13.10(2B2)

## Sheet 12 of 19: RAM
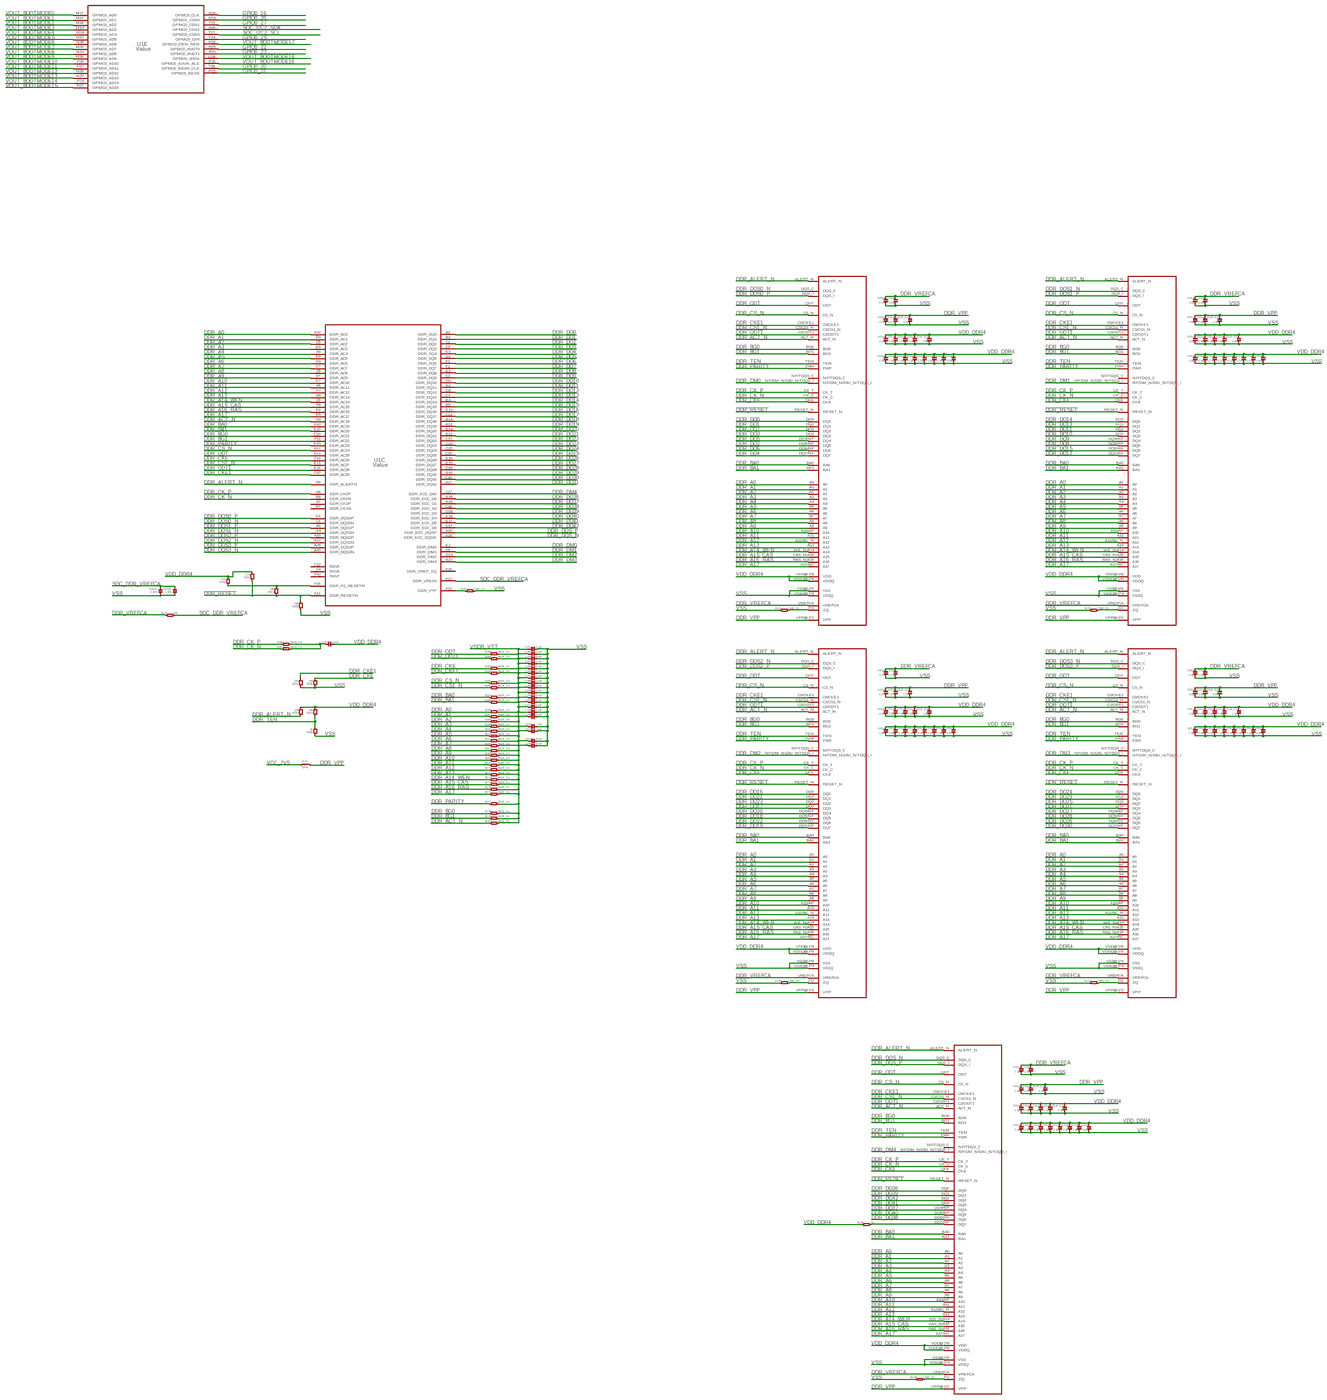
[diagram p21: schematic, sheet 12, overview]
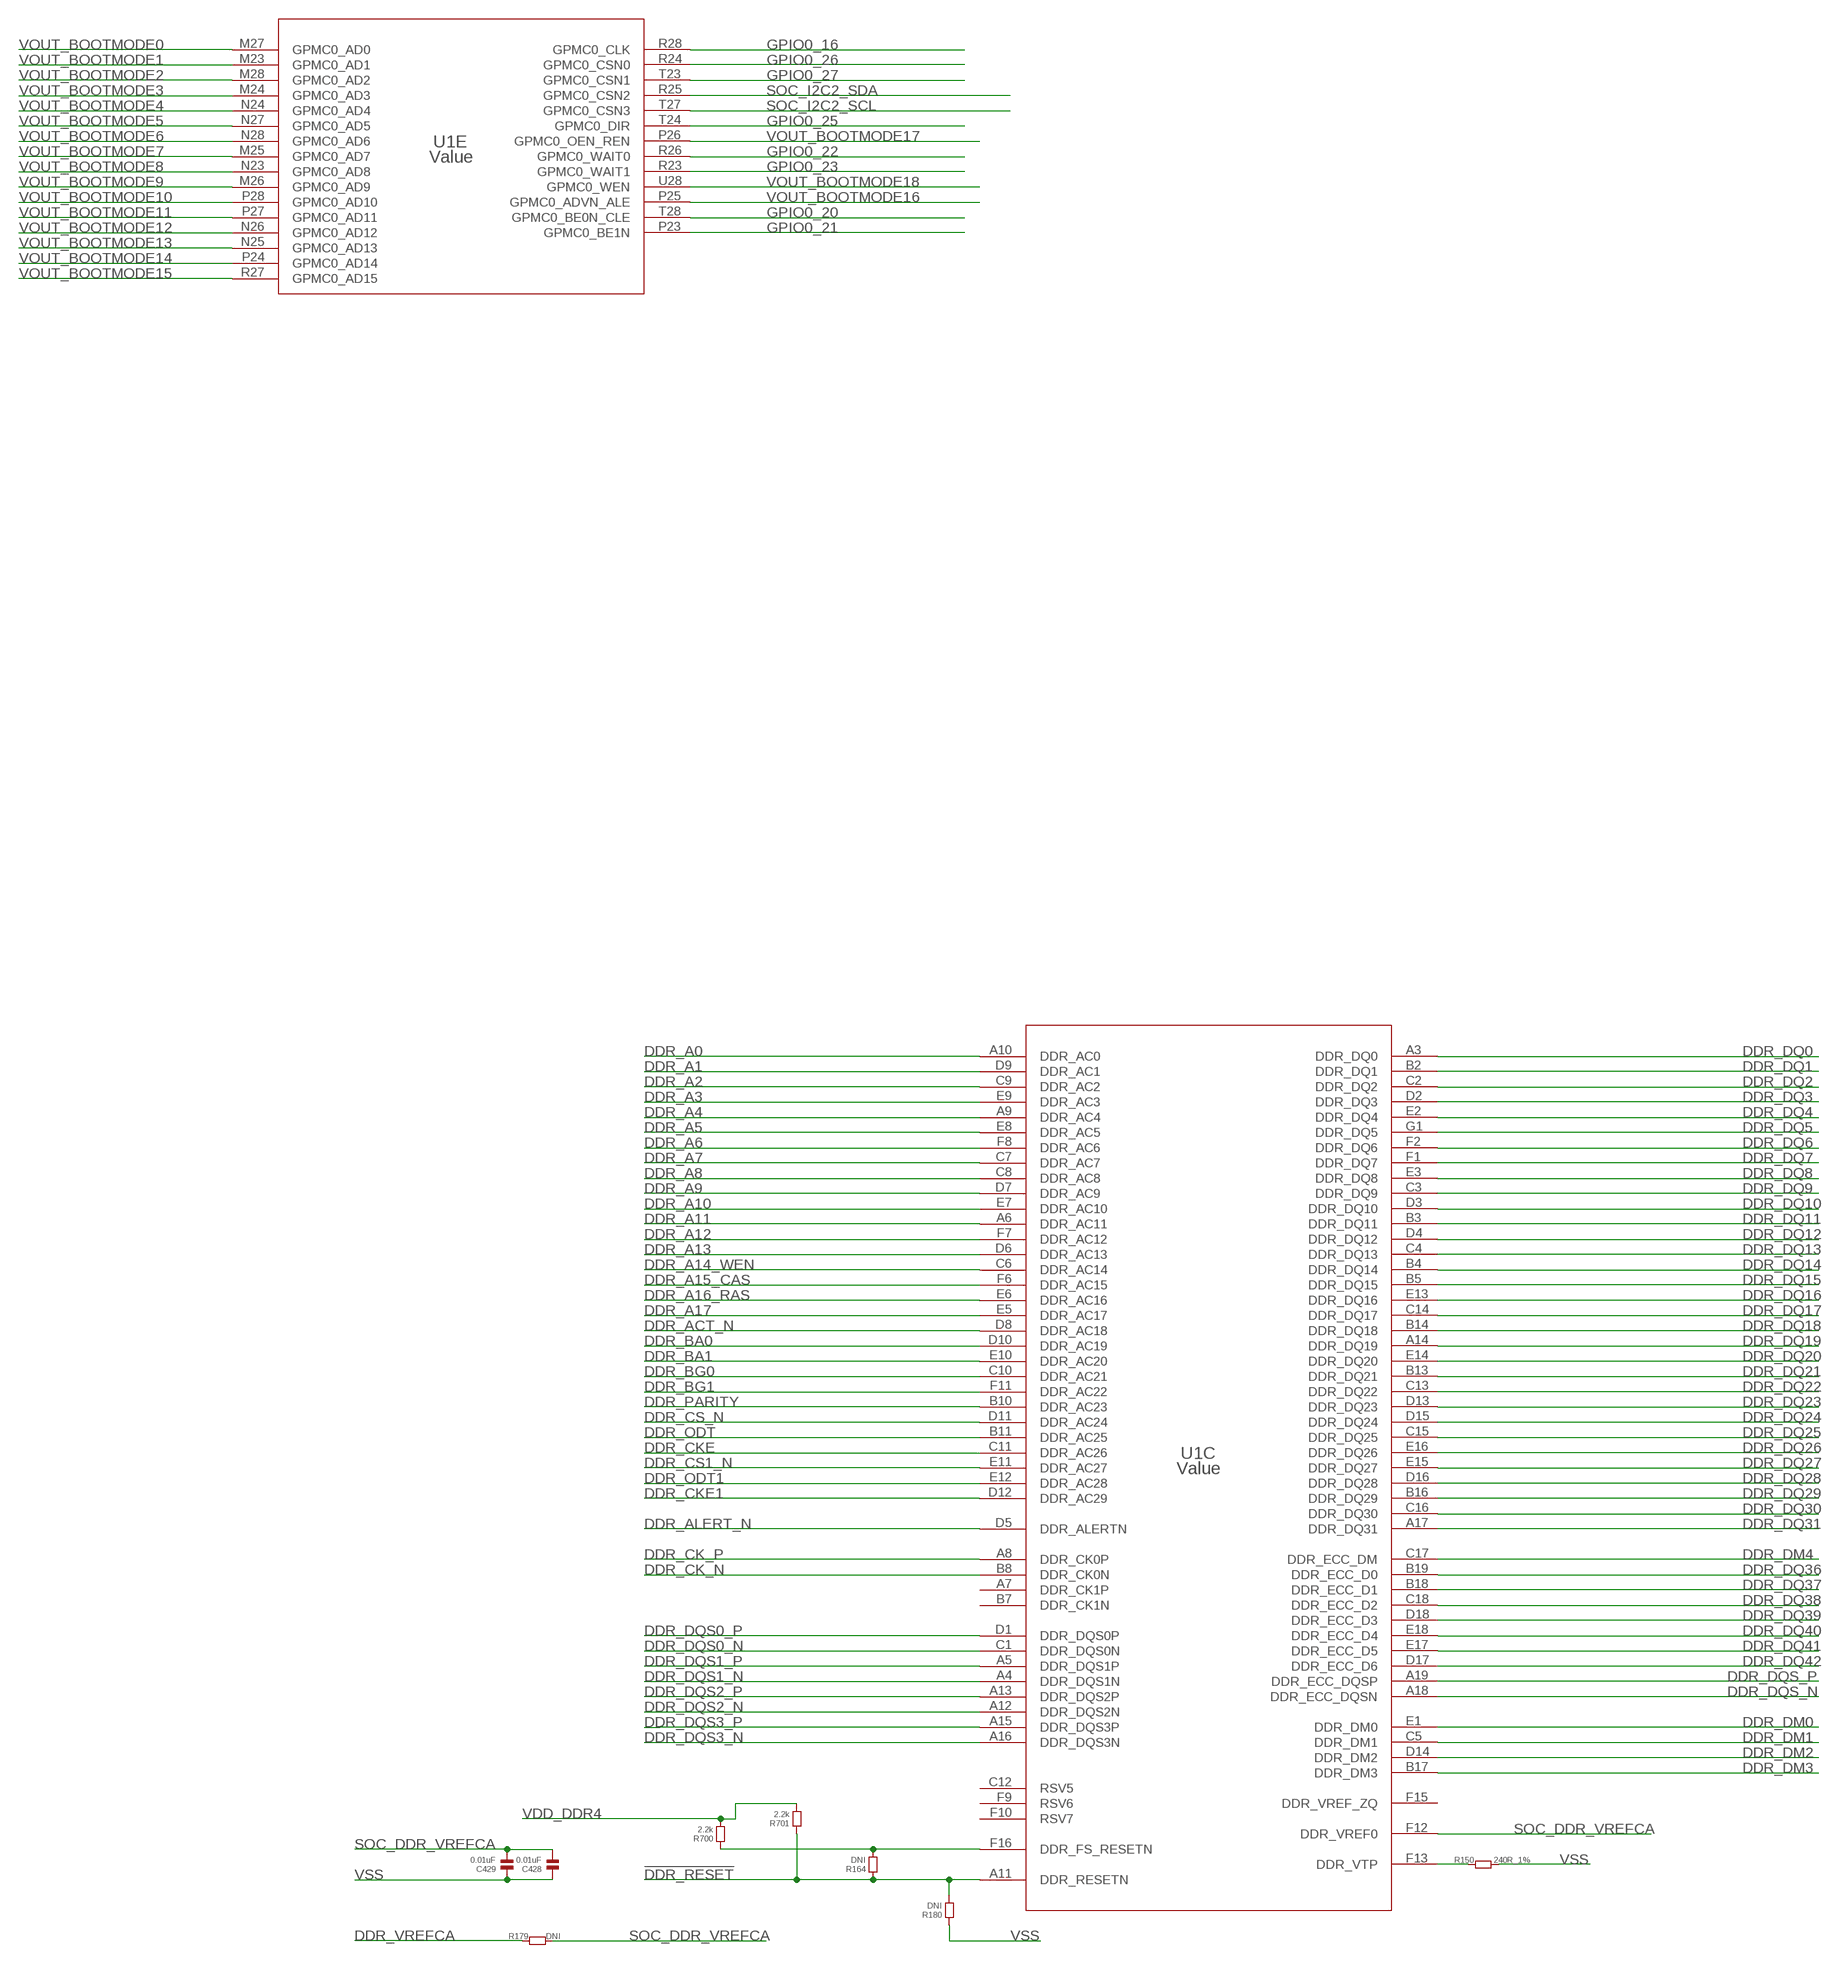
[diagram p22: schematic, sheet 12, part 1 of 4]
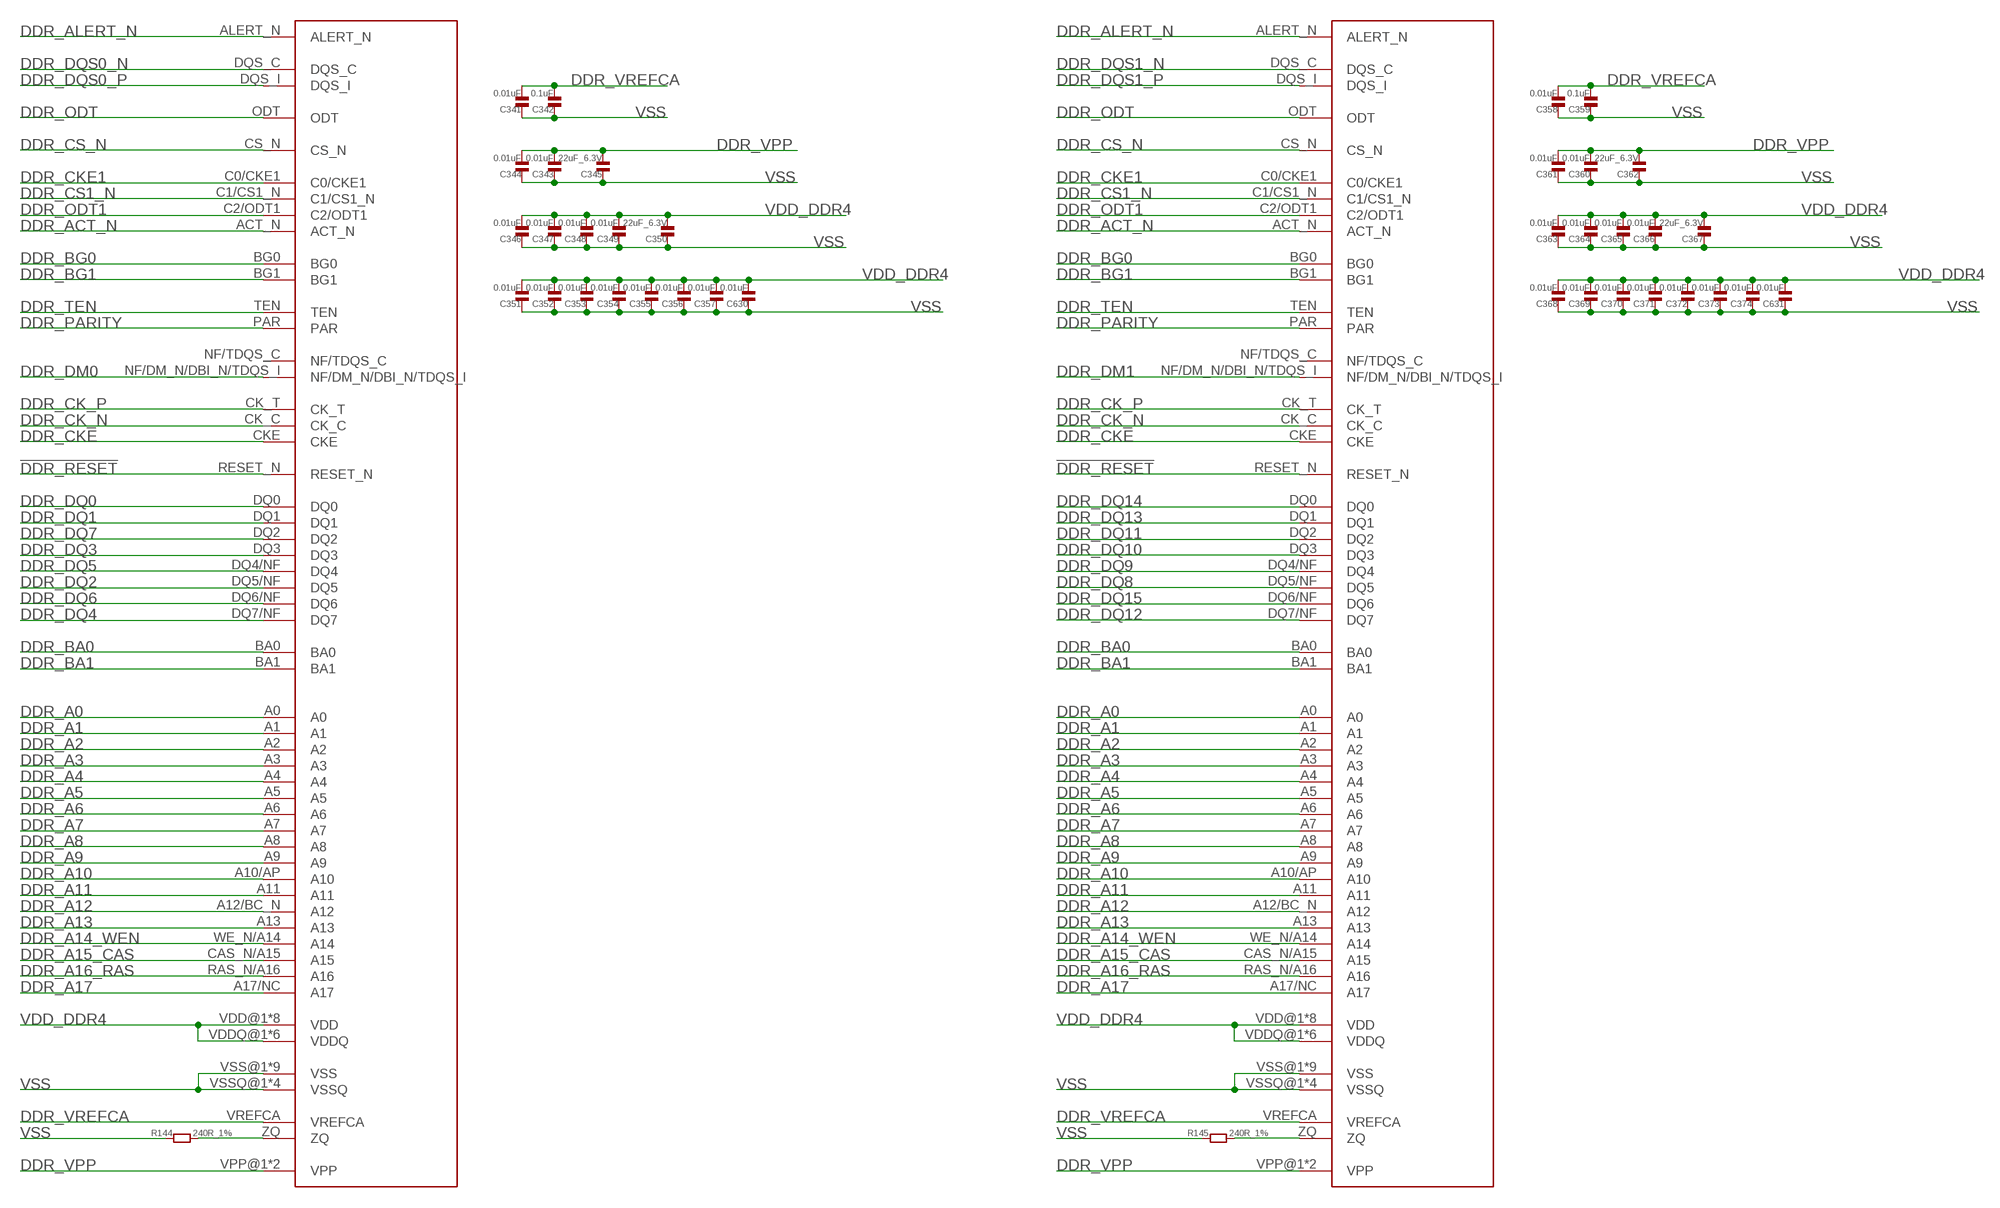
[diagram p23: schematic, sheet 12, part 2 of 4]
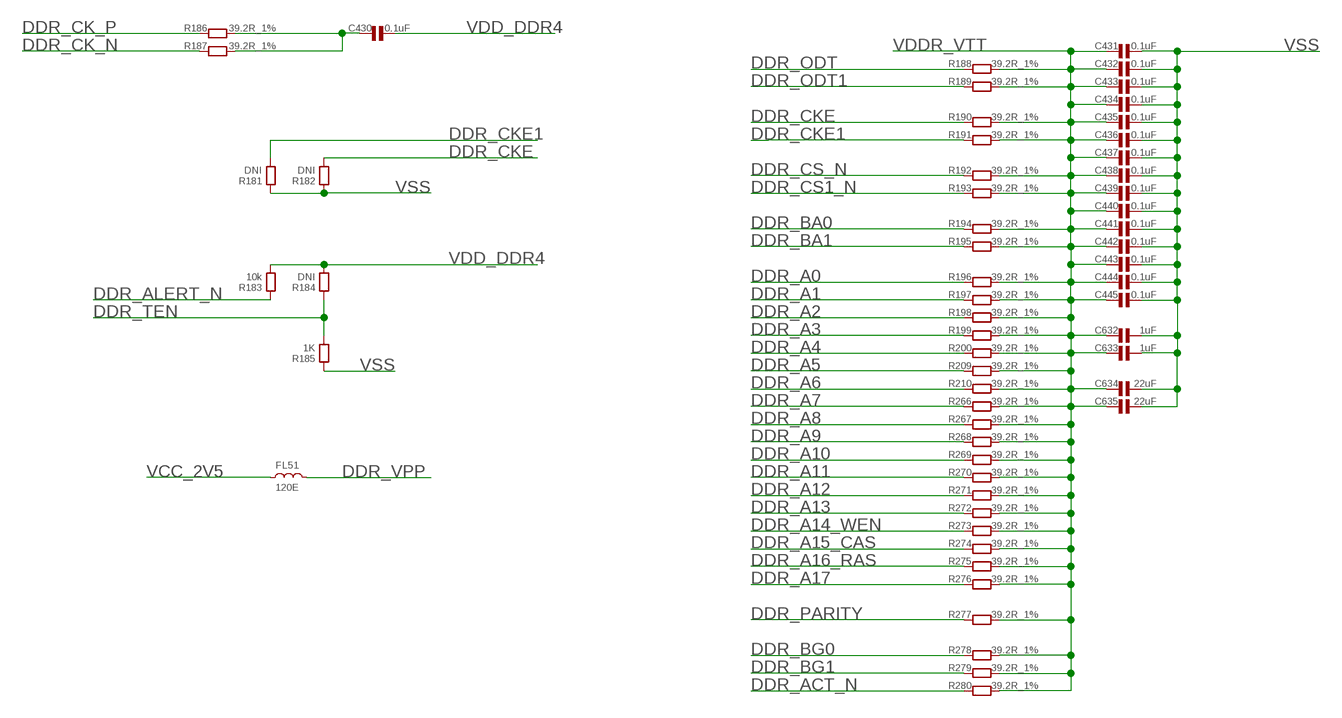
[diagram p24: schematic, sheet 12, part 3 of 4]
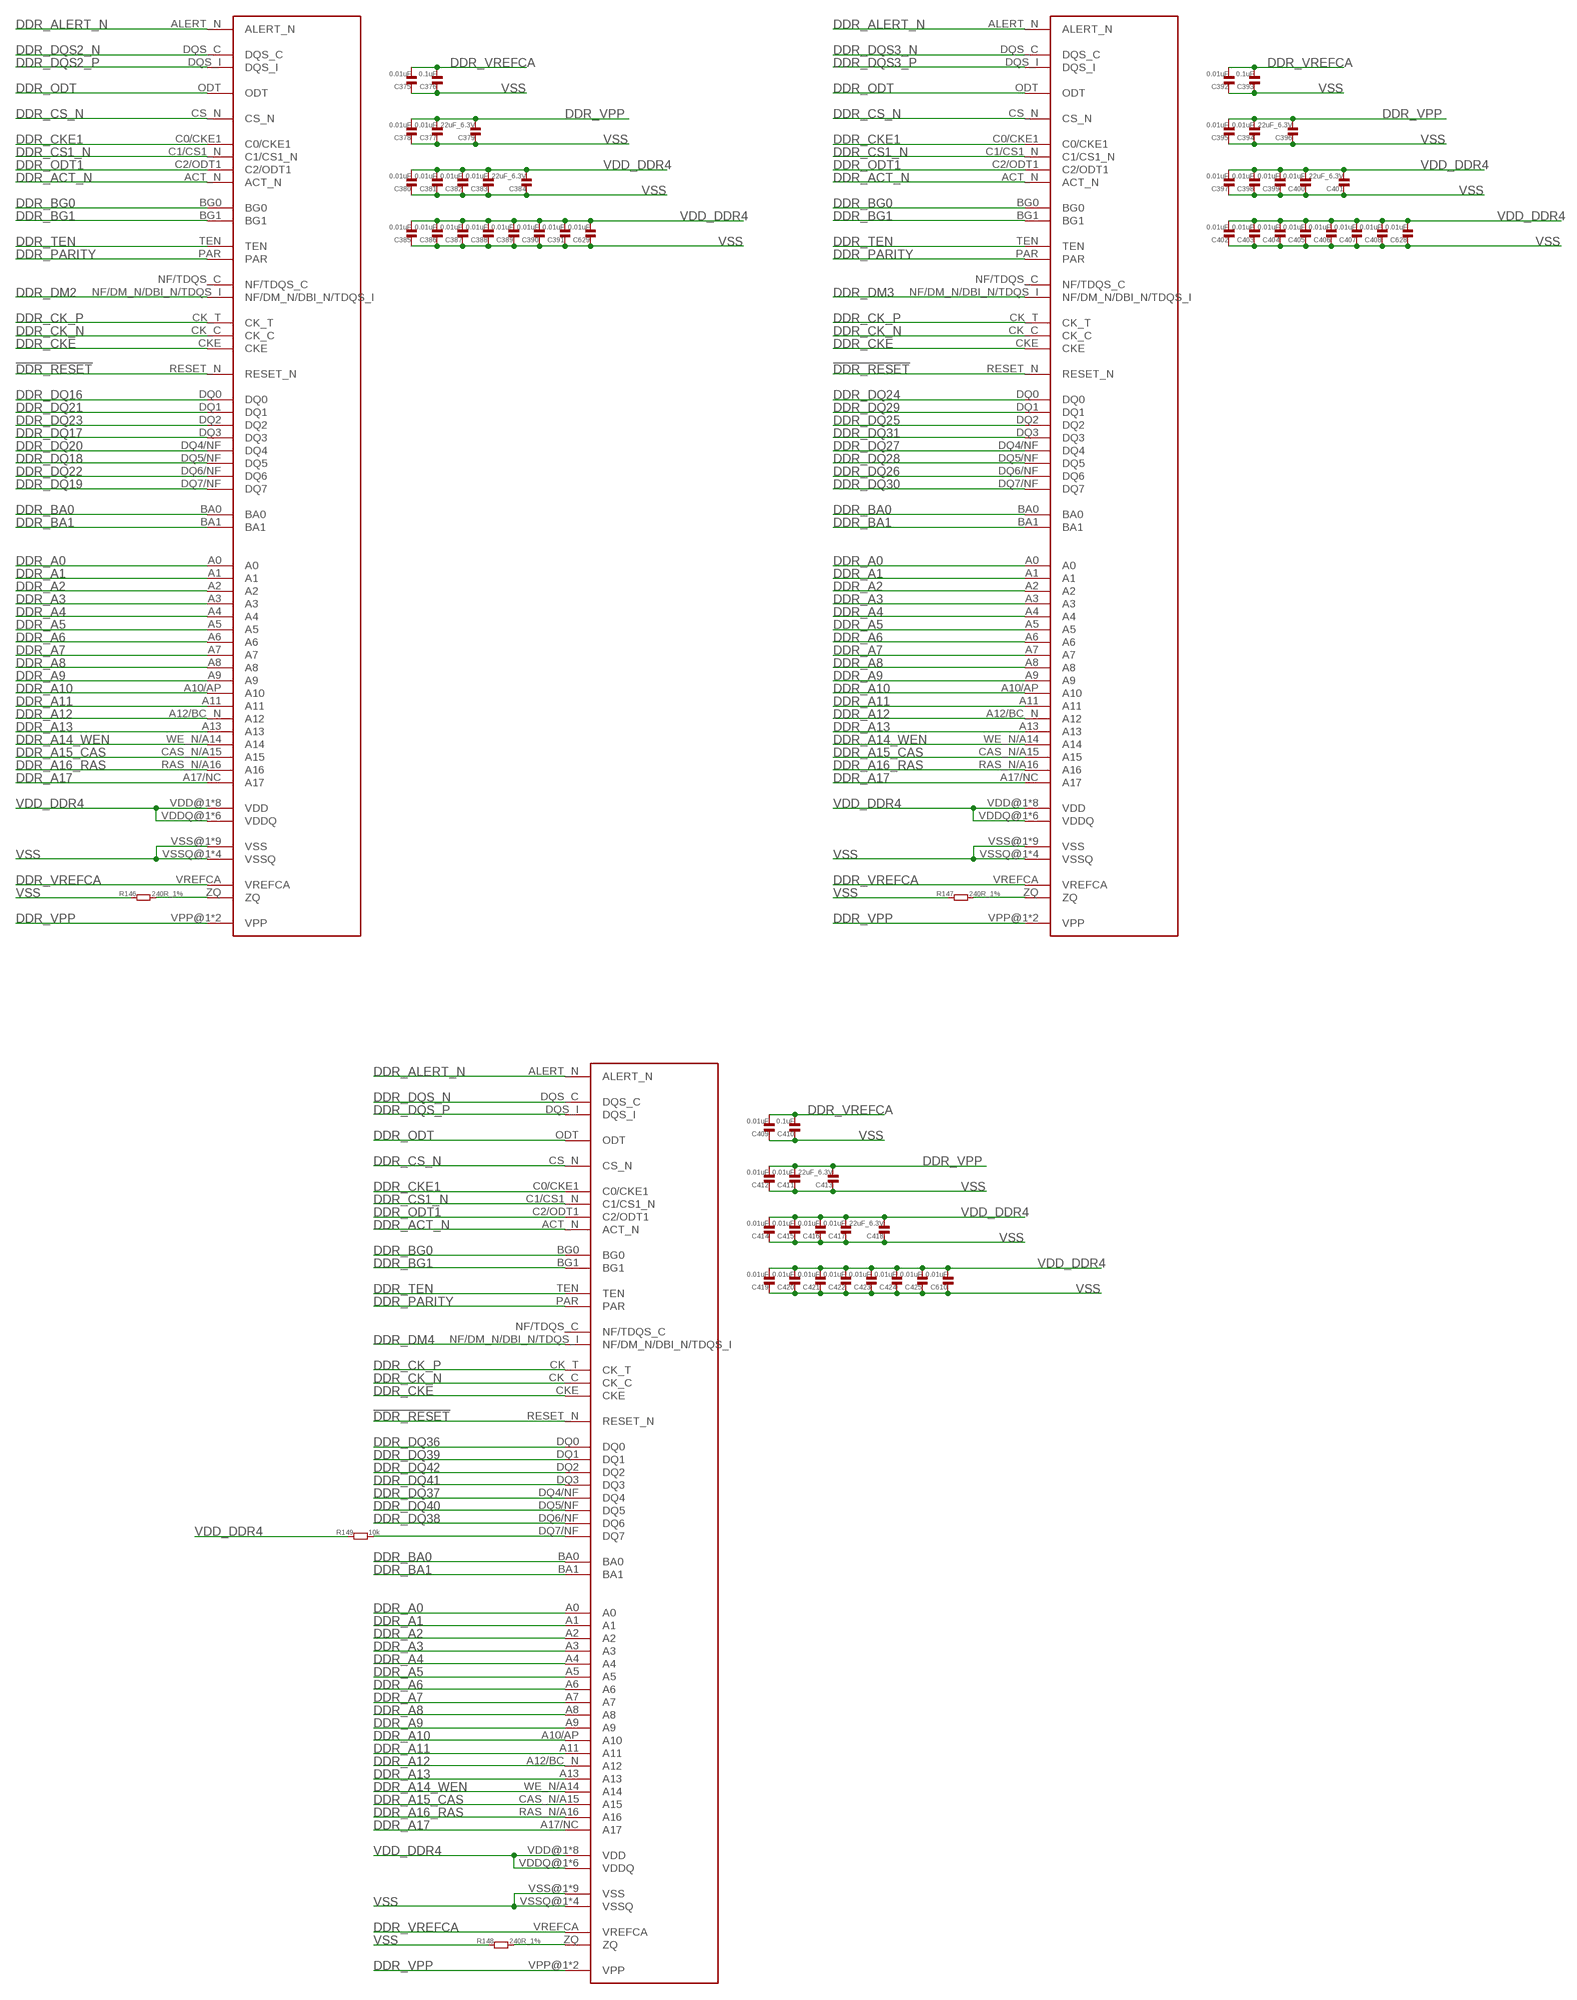
[diagram p25: schematic, sheet 12, part 4 of 4]

### Parts
C341  0.01uF  CAPACITOR.0402  [0402]
C342  0.1uF  CAPACITOR.0402  [0402]
C343  0.01uF  CAPACITOR.0402  [0402]
C344  0.01uF  CAPACITOR.0402  [0402]
C345  22uF_6.3V  CAPACITOR.0402  [0402]
C346  0.01uF  CAPACITOR.0201  [0201]
C347  0.01uF  CAPACITOR.0201  [0201]
C348  0.01uF  CAPACITOR.0201  [0201]
C349  0.01uF  CAPACITOR.0201  [0201]
C350  22uF_6.3V  CAPACITOR.0402  [0402]
C351  0.01uF  CAPACITOR.0201  [0201]
C352  0.01uF  CAPACITOR.0201  [0201]
C353  0.01uF  CAPACITOR.0201  [0201]
C354  0.01uF  CAPACITOR.0201  [0201]
C355  0.01uF  CAPACITOR.0201  [0201]
C356  0.01uF  CAPACITOR.0201  [0201]
C357  0.01uF  CAPACITOR.0201  [0201]
C358  0.01uF  CAPACITOR.0402  [0402]
C359  0.1uF  CAPACITOR.0402  [0402]
C360  0.01uF  CAPACITOR.0402  [0402]
C361  0.01uF  CAPACITOR.0402  [0402]
C362  22uF_6.3V  CAPACITOR.0402  [0402]
C363  0.01uF  CAPACITOR.0201  [0201]
C364  0.01uF  CAPACITOR.0201  [0201]
C365  0.01uF  CAPACITOR.0201  [0201]
C366  0.01uF  CAPACITOR.0201  [0201]
C367  22uF_6.3V  CAPACITOR.0402  [0402]
C368  0.01uF  CAPACITOR.0201  [0201]
C369  0.01uF  CAPACITOR.0201  [0201]
C370  0.01uF  CAPACITOR.0201  [0201]
C371  0.01uF  CAPACITOR.0201  [0201]
C372  0.01uF  CAPACITOR.0201  [0201]
C373  0.01uF  CAPACITOR.0201  [0201]
C374  0.01uF  CAPACITOR.0201  [0201]
C375  0.01uF  CAPACITOR.0402  [0402]
C376  0.1uF  CAPACITOR.0402  [0402]
C377  0.01uF  CAPACITOR.0402  [0402]
C378  0.01uF  CAPACITOR.0402  [0402]
C379  22uF_6.3V  CAPACITOR.0402  [0402]
C380  0.01uF  CAPACITOR.0201  [0201]
C381  0.01uF  CAPACITOR.0201  [0201]
C382  0.01uF  CAPACITOR.0201  [0201]
C383  0.01uF  CAPACITOR.0201  [0201]
C384  22uF_6.3V  CAPACITOR.0402  [0402]
C385  0.01uF  CAPACITOR.0201  [0201]
C386  0.01uF  CAPACITOR.0201  [0201]
C387  0.01uF  CAPACITOR.0201  [0201]
C388  0.01uF  CAPACITOR.0201  [0201]
C389  0.01uF  CAPACITOR.0201  [0201]
C390  0.01uF  CAPACITOR.0201  [0201]
C391  0.01uF  CAPACITOR.0201  [0201]
C392  0.01uF  CAPACITOR.0402  [0402]
C393  0.1uF  CAPACITOR.0402  [0402]
C394  0.01uF  CAPACITOR.0402  [0402]
C395  0.01uF  CAPACITOR.0402  [0402]
C396  22uF_6.3V  CAPACITOR.0402  [0402]
C397  0.01uF  CAPACITOR.0201  [0201]
C398  0.01uF  CAPACITOR.0201  [0201]
C399  0.01uF  CAPACITOR.0201  [0201]
C400  0.01uF  CAPACITOR.0201  [0201]
C401  22uF_6.3V  CAPACITOR.0402  [0402]
C402  0.01uF  CAPACITOR.0201  [0201]
C403  0.01uF  CAPACITOR.0201  [0201]
C404  0.01uF  CAPACITOR.0201  [0201]
C405  0.01uF  CAPACITOR.0201  [0201]
C406  0.01uF  CAPACITOR.0201  [0201]
C407  0.01uF  CAPACITOR.0201  [0201]
C408  0.01uF  CAPACITOR.0201  [0201]
C409  0.01uF  CAPACITOR.0402  [0402]
C410  0.1uF  CAPACITOR.0402  [0402]
C411  0.01uF  CAPACITOR.0402  [0402]
C412  0.01uF  CAPACITOR.0402  [0402]
C413  22uF_6.3V  CAPACITOR.0402  [0402]
C414  0.01uF  CAPACITOR.0201  [0201]
C415  0.01uF  CAPACITOR.0201  [0201]
C416  0.01uF  CAPACITOR.0201  [0201]
C417  0.01uF  CAPACITOR.0201  [0201]
C418  22uF_6.3V  CAPACITOR.0402  [0402]
C419  0.01uF  CAPACITOR.0201  [0201]
C420  0.01uF  CAPACITOR.0201  [0201]
C421  0.01uF  CAPACITOR.0201  [0201]
C422  0.01uF  CAPACITOR.0201  [0201]
C423  0.01uF  CAPACITOR.0201  [0201]
C424  0.01uF  CAPACITOR.0201  [0201]
C425  0.01uF  CAPACITOR.0201  [0201]
C428  0.01uF  CAPACITOR.0201  [0201]
C429  0.01uF  CAPACITOR.0201  [0201]
C430  0.1uF  CAPACITOR.0201  [0201]
C431  0.1uF  CAPACITOR.0201  [0201]
C432  0.1uF  CAPACITOR.0201  [0201]
C433  0.1uF  CAPACITOR.0201  [0201]
C434  0.1uF  CAPACITOR.0201  [0201]
C435  0.1uF  CAPACITOR.0201  [0201]
C436  0.1uF  CAPACITOR.0201  [0201]
C437  0.1uF  CAPACITOR.0201  [0201]
C438  0.1uF  CAPACITOR.0201  [0201]
C439  0.1uF  CAPACITOR.0201  [0201]
C440  0.1uF  CAPACITOR.0201  [0201]
C441  0.1uF  CAPACITOR.0201  [0201]
C442  0.1uF  CAPACITOR.0201  [0201]
C443  0.1uF  CAPACITOR.0201  [0201]
C444  0.1uF  CAPACITOR.0201  [0201]
C445  0.1uF  CAPACITOR.0201  [0201]
C610  0.01uF  CAPACITOR.0201  [0201]
C628  0.01uF  CAPACITOR.0201  [0201]
C629  0.01uF  CAPACITOR.0201  [0201]
C630  0.01uF  CAPACITOR.0201  [0201]
C631  0.01uF  CAPACITOR.0201  [0201]
C632  1uF  CAPACITOR.0402  [0402]
C633  1uF  CAPACITOR.0402  [0402]
C634  22uF  CAPACITOR.0402  [0402]
C635  22uF  CAPACITOR.0402  [0402]
FL51  120E  RF-INDUCTOR.0402  [0402]
R144  240R_1%  RESISTOR.0402  [0402]
R145  240R_1%  RESISTOR.0402  [0402]
R146  240R_1%  RESISTOR.0402  [0402]
R147  240R_1%  RESISTOR.0402  [0402]
R148  240R_1%  RESISTOR.0402  [0402]
R149  10k  RESISTOR.0402  [0402]
R150  240R_1%  RESISTOR.0402  [0402]
R164  DNI  RESISTOR.0201  [0201]
R179  DNI  RESISTOR.0603  [0603]
R180  DNI  RESISTOR.0201  [0201]
R181  DNI  RESISTOR.0201  [0201]
R182  DNI  RESISTOR.0201  [0201]
R183  10k  RESISTOR.0201  [0201]
R184  DNI  RESISTOR.0201  [0201]
R185  1K  RESISTOR.0201  [0201]
R186  39.2R_1%  RESISTOR.0201  [0201]
R187  39.2R_1%  RESISTOR.0201  [0201]
R188  39.2R_1%  RESISTOR.0201  [0201]
R189  39.2R_1%  RESISTOR.0201  [0201]
R190  39.2R_1%  RESISTOR.0201  [0201]
R191  39.2R_1%  RESISTOR.0201  [0201]
R192  39.2R_1%  RESISTOR.0201  [0201]
R193  39.2R_1%  RESISTOR.0201  [0201]
R194  39.2R_1%  RESISTOR.0201  [0201]
R195  39.2R_1%  RESISTOR.0201  [0201]
R196  39.2R_1%  RESISTOR.0201  [0201]
R197  39.2R_1%  RESISTOR.0201  [0201]
R198  39.2R_1%  RESISTOR.0201  [0201]
R199  39.2R_1%  RESISTOR.0201  [0201]
R200  39.2R_1%  RESISTOR.0201  [0201]
R209  39.2R_1%  RESISTOR.0201  [0201]
R210  39.2R_1%  RESISTOR.0201  [0201]
R266  39.2R_1%  RESISTOR.0201  [0201]
R267  39.2R_1%  RESISTOR.0201  [0201]
R268  39.2R_1%  RESISTOR.0201  [0201]
R269  39.2R_1%  RESISTOR.0201  [0201]
R270  39.2R_1%  RESISTOR.0201  [0201]
R271  39.2R_1%  RESISTOR.0201  [0201]
R272  39.2R_1%  RESISTOR.0201  [0201]
R273  39.2R_1%  RESISTOR.0201  [0201]
R274  39.2R_1%  RESISTOR.0201  [0201]
R275  39.2R_1%  RESISTOR.0201  [0201]
R276  39.2R_1%  RESISTOR.0201  [0201]
R277  39.2R_1%  RESISTOR.0201  [0201]
R278  39.2R_1%  RESISTOR.0201  [0201]
R279  39.2R_1%  RESISTOR.0201  [0201]
R280  39.2R_1%  RESISTOR.0201  [0201]
R700  2.2k  RESISTOR.0201  [0201]
R701  2.2k  RESISTOR.0201  [0201]
U$3  MT40A1G8WE-083E:B  [MT40A1G8WE-083E:B]
U$4  MT40A1G8WE-083E:B  [MT40A1G8WE-083E:B]
U$5  MT40A1G8WE-083E:B  [MT40A1G8WE-083E:B]
U$6  MT40A1G8WE-083E:B  [MT40A1G8WE-083E:B]
U$7  MT40A1G8WE-083E:B  [MT40A1G8WE-083E:B]

### Nets
!DDR_RESET: R164.1 R180.2 R701.1 U1.A11(C:DDR_RESETN) U$3.RESET_N U$4.RESET_N U$5.RESET_N U$6.RESET_N U$7.RESET_N
DDR_A0 [addr]: R196.1 U1.A10(C:DDR_AC0) U$3.A0 U$4.A0 U$5.A0 U$6.A0 U$7.A0
DDR_A1 [addr]: R197.1 U1.D9(C:DDR_AC1) U$3.A1 U$4.A1 U$5.A1 U$6.A1 U$7.A1
DDR_A2 [addr]: R198.1 U1.C9(C:DDR_AC2) U$3.A2 U$4.A2 U$5.A2 U$6.A2 U$7.A2
DDR_A3 [addr]: R199.1 U1.E9(C:DDR_AC3) U$3.A3 U$4.A3 U$5.A3 U$6.A3 U$7.A3
DDR_A4 [addr]: R200.1 U1.A9(C:DDR_AC4) U$3.A4 U$4.A4 U$5.A4 U$6.A4 U$7.A4
DDR_A5 [addr]: R209.1 U1.E8(C:DDR_AC5) U$3.A5 U$4.A5 U$5.A5 U$6.A5 U$7.A5
DDR_A6 [addr]: R210.1 U1.F8(C:DDR_AC6) U$3.A6 U$4.A6 U$5.A6 U$6.A6 U$7.A6
DDR_A7 [addr]: R266.1 U1.C7(C:DDR_AC7) U$3.A7 U$4.A7 U$5.A7 U$6.A7 U$7.A7
DDR_A8 [addr]: R267.1 U1.C8(C:DDR_AC8) U$3.A8 U$4.A8 U$5.A8 U$6.A8 U$7.A8
DDR_A9 [addr]: R268.1 U1.D7(C:DDR_AC9) U$3.A9 U$4.A9 U$5.A9 U$6.A9 U$7.A9
DDR_A10 [addr]: R269.1 U1.E7(C:DDR_AC10) U$3.A10/AP(A10) U$4.A10/AP(A10) U$5.A10/AP(A10) U$6.A10/AP(A10) U$7.A10/AP(A10)
DDR_A11 [addr]: R270.1 U1.A6(C:DDR_AC11) U$3.A11 U$4.A11 U$5.A11 U$6.A11 U$7.A11
DDR_A12 [addr]: R271.1 U1.F7(C:DDR_AC12) U$3.A12/BC_N(A12) U$4.A12/BC_N(A12) U$5.A12/BC_N(A12) U$6.A12/BC_N(A12) U$7.A12/BC_N(A12)
DDR_A13 [addr]: R272.1 U1.D6(C:DDR_AC13) U$3.A13 U$4.A13 U$5.A13 U$6.A13 U$7.A13
DDR_A14_WEN [addr]: R273.1 U1.C6(C:DDR_AC14) U$3.WE_N/A14(A14) U$4.WE_N/A14(A14) U$5.WE_N/A14(A14) U$6.WE_N/A14(A14) U$7.WE_N/A14(A14)
DDR_A15_CAS [addr]: R274.1 U1.F6(C:DDR_AC15) U$3.CAS_N/A15(A15) U$4.CAS_N/A15(A15) U$5.CAS_N/A15(A15) U$6.CAS_N/A15(A15) U$7.CAS_N/A15(A15)
DDR_A16_RAS [addr]: R275.1 U1.E6(C:DDR_AC16) U$3.RAS_N/A16(A16) U$4.RAS_N/A16(A16) U$5.RAS_N/A16(A16) U$6.RAS_N/A16(A16) U$7.RAS_N/A16(A16)
DDR_A17 [addr]: R276.1 U1.E5(C:DDR_AC17) U$3.A17/NC(A17) U$4.A17/NC(A17) U$5.A17/NC(A17) U$6.A17/NC(A17) U$7.A17/NC(A17)
DDR_ACT_N [ctrl]: R280.1 U1.D8(C:DDR_AC18) U$3.ACT_N U$4.ACT_N U$5.ACT_N U$6.ACT_N U$7.ACT_N
DDR_ALERT_N [ctrl]: R183.1 U1.D5(C:DDR_ALERTN) U$3.ALERT_N U$4.ALERT_N U$5.ALERT_N U$6.ALERT_N U$7.ALERT_N
DDR_BA0 [ctrl]: R194.1 U1.D10(C:DDR_AC19) U$3.BA0 U$4.BA0 U$5.BA0 U$6.BA0 U$7.BA0
DDR_BA1 [ctrl]: R195.1 U1.E10(C:DDR_AC20) U$3.BA1 U$4.BA1 U$5.BA1 U$6.BA1 U$7.BA1
DDR_BG0 [ctrl]: R278.1 U1.C10(C:DDR_AC21) U$3.BG0 U$4.BG0 U$5.BG0 U$6.BG0 U$7.BG0
DDR_BG1 [ctrl]: R279.1 U1.F11(C:DDR_AC22) U$3.BG1 U$4.BG1 U$5.BG1 U$6.BG1 U$7.BG1
DDR_CK_N [clk]: R187.1 U1.B8(C:DDR_CK0N) U$3.CK_C U$4.CK_C U$5.CK_C U$6.CK_C U$7.CK_C
DDR_CK_P [clk]: R186.1 U1.A8(C:DDR_CK0P) U$3.CK_T U$4.CK_T U$5.CK_T U$6.CK_T U$7.CK_T
DDR_CKE [ctrl]: R182.2 R190.1 U1.C11(C:DDR_AC26) U$3.CKE U$4.CKE U$5.CKE U$6.CKE U$7.CKE
DDR_CKE1 [ctrl]: R181.2 R191.1 U1.D12(C:DDR_AC29) U$3.C0/CKE1 U$4.C0/CKE1 U$5.C0/CKE1 U$6.C0/CKE1 U$7.C0/CKE1
DDR_CS1_N [ctrl]: R193.1 U1.E11(C:DDR_AC27) U$3.C1/CS1_N U$4.C1/CS1_N U$5.C1/CS1_N U$6.C1/CS1_N U$7.C1/CS1_N
DDR_CS_N [ctrl]: R192.1 U1.D11(C:DDR_AC24) U$3.CS_N U$4.CS_N U$5.CS_N U$6.CS_N U$7.CS_N
DDR_DM0 [dm]: U1.E1(C:DDR_DM0) U$3.NF/DM_N/DBI_N/TDQS_I
DDR_DM1 [dm]: U1.C5(C:DDR_DM1) U$4.NF/DM_N/DBI_N/TDQS_I
DDR_DM2 [dm]: U1.D14(C:DDR_DM2) U$5.NF/DM_N/DBI_N/TDQS_I
DDR_DM3 [dm]: U1.B17(C:DDR_DM3) U$6.NF/DM_N/DBI_N/TDQS_I
DDR_DM4 [dm]: U1.C17(C:DDR_ECC_DM) U$7.NF/DM_N/DBI_N/TDQS_I
DDR_DQ0 [data]: U1.A3(C:DDR_DQ0) U$3.DQ0
DDR_DQ1 [data]: U1.B2(C:DDR_DQ1) U$3.DQ1
DDR_DQ2 [data]: U1.C2(C:DDR_DQ2) U$3.DQ5/NF(DQ5)
DDR_DQ3 [data]: U1.D2(C:DDR_DQ3) U$3.DQ3
DDR_DQ4 [data]: U1.E2(C:DDR_DQ4) U$3.DQ7/NF(DQ7)
DDR_DQ5 [data]: U1.G1(C:DDR_DQ5) U$3.DQ4/NF(DQ4)
DDR_DQ6 [data]: U1.F2(C:DDR_DQ6) U$3.DQ6/NF(DQ6)
DDR_DQ7 [data]: U1.F1(C:DDR_DQ7) U$3.DQ2
DDR_DQ8 [data]: U1.E3(C:DDR_DQ8) U$4.DQ5/NF(DQ5)
DDR_DQ9 [data]: U1.C3(C:DDR_DQ9) U$4.DQ4/NF(DQ4)
DDR_DQ10 [data]: U1.D3(C:DDR_DQ10) U$4.DQ3
DDR_DQ11 [data]: U1.B3(C:DDR_DQ11) U$4.DQ2
DDR_DQ12 [data]: U1.D4(C:DDR_DQ12) U$4.DQ7/NF(DQ7)
DDR_DQ13 [data]: U1.C4(C:DDR_DQ13) U$4.DQ1
DDR_DQ14 [data]: U1.B4(C:DDR_DQ14) U$4.DQ0
DDR_DQ15 [data]: U1.B5(C:DDR_DQ15) U$4.DQ6/NF(DQ6)
DDR_DQ16 [data]: U1.E13(C:DDR_DQ16) U$5.DQ0
DDR_DQ17 [data]: U1.C14(C:DDR_DQ17) U$5.DQ3
DDR_DQ18 [data]: U1.B14(C:DDR_DQ18) U$5.DQ5/NF(DQ5)
DDR_DQ19 [data]: U1.A14(C:DDR_DQ19) U$5.DQ7/NF(DQ7)
DDR_DQ20 [data]: U1.E14(C:DDR_DQ20) U$5.DQ4/NF(DQ4)
DDR_DQ21 [data]: U1.B13(C:DDR_DQ21) U$5.DQ1
DDR_DQ22 [data]: U1.C13(C:DDR_DQ22) U$5.DQ6/NF(DQ6)
DDR_DQ23 [data]: U1.D13(C:DDR_DQ23) U$5.DQ2
DDR_DQ24 [data]: U1.D15(C:DDR_DQ24) U$6.DQ0
DDR_DQ25 [data]: U1.C15(C:DDR_DQ25) U$6.DQ2
DDR_DQ26 [data]: U1.E16(C:DDR_DQ26) U$6.DQ6/NF(DQ6)
DDR_DQ27 [data]: U1.E15(C:DDR_DQ27) U$6.DQ4/NF(DQ4)
DDR_DQ28 [data]: U1.D16(C:DDR_DQ28) U$6.DQ5/NF(DQ5)
DDR_DQ29 [data]: U1.B16(C:DDR_DQ29) U$6.DQ1
DDR_DQ30 [data]: U1.C16(C:DDR_DQ30) U$6.DQ7/NF(DQ7)
DDR_DQ31 [data]: U1.A17(C:DDR_DQ31) U$6.DQ3
DDR_DQ36 [data]: U1.B19(C:DDR_ECC_D0) U$7.DQ0
DDR_DQ37 [data]: U1.B18(C:DDR_ECC_D1) U$7.DQ4/NF(DQ4)
DDR_DQ38 [data]: U1.C18(C:DDR_ECC_D2) U$7.DQ6/NF(DQ6)
DDR_DQ39 [data]: U1.D18(C:DDR_ECC_D3) U$7.DQ1
DDR_DQ40 [data]: U1.E18(C:DDR_ECC_D4) U$7.DQ5/NF(DQ5)
DDR_DQ41 [data]: U1.E17(C:DDR_ECC_D5) U$7.DQ3
DDR_DQ42 [data]: U1.D17(C:DDR_ECC_D6) U$7.DQ2
DDR_DQS0_N [dqs]: U1.C1(C:DDR_DQS0N) U$3.DQS_C
DDR_DQS0_P [dqs]: U1.D1(C:DDR_DQS0P) U$3.DQS_I
DDR_DQS1_N [dqs]: U1.A4(C:DDR_DQS1N) U$4.DQS_C
DDR_DQS1_P [dqs]: U1.A5(C:DDR_DQS1P) U$4.DQS_I
DDR_DQS2_N [dqs]: U1.A12(C:DDR_DQS2N) U$5.DQS_C
DDR_DQS2_P [dqs]: U1.A13(C:DDR_DQS2P) U$5.DQS_I
DDR_DQS3_N [dqs]: U1.A16(C:DDR_DQS3N) U$6.DQS_C
DDR_DQS3_P [dqs]: U1.A15(C:DDR_DQS3P) U$6.DQS_I
DDR_DQS_N [dqs]: U1.A18(C:DDR_ECC_DQSN) U$7.DQS_C
DDR_DQS_P [dqs]: U1.A19(C:DDR_ECC_DQSP) U$7.DQS_I
DDR_ODT [ctrl]: R188.1 U1.B11(C:DDR_AC25) U$3.ODT U$4.ODT U$5.ODT U$6.ODT U$7.ODT
DDR_ODT1 [ctrl]: R189.1 U1.E12(C:DDR_AC28) U$3.C2/ODT1 U$4.C2/ODT1 U$5.C2/ODT1 U$6.C2/ODT1 U$7.C2/ODT1
DDR_PARITY [ctrl]: R277.1 U1.B10(C:DDR_AC23) U$3.PAR U$4.PAR U$5.PAR U$6.PAR U$7.PAR
DDR_TEN: R184.1 R185.2 U$3.TEN U$4.TEN U$5.TEN U$6.TEN U$7.TEN
DDR_VPP: C343.2 C344.2 C345.2 C360.2 C361.2 C362.2 C377.2 C378.2 C379.2 C394.2 C395.2 C396.2 C411.2 C412.2 C413.2 FL51.2 U$3.VPP@1(VPP) U$3.VPP@2(VPP) U$4.VPP@1(VPP) U$4.VPP@2(VPP) U$5.VPP@1(VPP) U$5.VPP@2(VPP) U$6.VPP@1(VPP) U$6.VPP@2(VPP) U$7.VPP@1(VPP) U$7.VPP@2(VPP)
DDR_VREFCA: C341.2 C342.2 C358.2 C359.2 C375.2 C376.2 C392.2 C393.2 C409.2 C410.2 R179.1 U$3.VREFCA U$4.VREFCA U$5.VREFCA U$6.VREFCA U$7.VREFCA ; also sheet 3
GPIO0_16: U1.R28(E:GPMC0_CLK) ; also sheet 19
GPIO0_20: U1.T28(E:GPMC0_BE0N_CLE) ; also sheet 19
GPIO0_21: U1.P23(E:GPMC0_BE1N) ; also sheet 19
GPIO0_22: U1.R26(E:GPMC0_WAIT0) ; also sheet 19
GPIO0_23: U1.R23(E:GPMC0_WAIT1) ; also sheet 19
GPIO0_25: U1.T24(E:GPMC0_DIR) ; also sheet 19
GPIO0_26: U1.R24(E:GPMC0_CSN0) ; also sheet 19
GPIO0_27: U1.T23(E:GPMC0_CSN1) ; also sheet 19
N$123: R144.2 U$3.ZQ
N$135: R145.2 U$4.ZQ
N$137: R146.2 U$5.ZQ
N$138: R147.2 U$6.ZQ
N$139: R148.2 U$7.ZQ
N$140: R149.2 U$7.DQ7/NF(DQ7)
N$141: R150.1 U1.F13(C:DDR_VTP)
N$142: R164.2 R700.1 U1.F16(C:DDR_FS_RESETN)
N$145: C430.1 R186.2 R187.2
SOC_DDR_VREFCA: C428.2 C429.2 R179.2 U1.F12(C:DDR_VREF0)
SOC_I2C2_SCL: U1.T27(E:GPMC0_CSN3) ; also sheet 8,10,15,19
SOC_I2C2_SDA: U1.R25(E:GPMC0_CSN2) ; also sheet 8,10,15,19
VCC_2V5: FL51.1 ; also sheet 3
VDD_DDR4: C346.2 C347.2 C348.2 C349.2 C350.2 C351.2 C352.2 C353.2 C354.2 C355.2 C356.2 C357.2 C363.2 C364.2 C365.2 C366.2 C367.2 C368.2 C369.2 C370.2 C371.2 C372.2 C373.2 C374.2 C380.2 C381.2 C382.2 C383.2 C384.2 C385.2 C386.2 C387.2 C388.2 C389.2 C390.2 C391.2 C397.2 C398.2 C399.2 C400.2 C401.2 C402.2 C403.2 C404.2 C405.2 C406.2 C407.2 C408.2 C414.2 C415.2 C416.2 C417.2 C418.2 C419.2 C420.2 C421.2 C422.2 C423.2 C424.2 C425.2 C430.2 C610.2 C628.2 C629.2 C630.2 C631.2 R149.1 R183.2 R184.2 R700.2 R701.2 U$3.VDD@1(VDD) U$3.VDD@2(VDD) U$3.VDD@3(VDD) U$3.VDD@4(VDD) U$3.VDD@5(VDD) U$3.VDD@6(VDD) U$3.VDD@7(VDD) U$3.VDD@8(VDD) U$3.VDDQ@1(VDDQ) U$3.VDDQ@2(VDDQ) U$3.VDDQ@3(VDDQ) U$3.VDDQ@4(VDDQ) U$3.VDDQ@5(VDDQ) U$3.VDDQ@6(VDDQ) U$4.VDD@1(VDD) U$4.VDD@2(VDD) U$4.VDD@3(VDD) U$4.VDD@4(VDD) U$4.VDD@5(VDD) U$4.VDD@6(VDD) U$4.VDD@7(VDD) U$4.VDD@8(VDD) U$4.VDDQ@1(VDDQ) U$4.VDDQ@2(VDDQ) U$4.VDDQ@3(VDDQ) U$4.VDDQ@4(VDDQ) U$4.VDDQ@5(VDDQ) U$4.VDDQ@6(VDDQ) U$5.VDD@1(VDD) U$5.VDD@2(VDD) U$5.VDD@3(VDD) U$5.VDD@4(VDD) U$5.VDD@5(VDD) U$5.VDD@6(VDD) U$5.VDD@7(VDD) U$5.VDD@8(VDD) U$5.VDDQ@1(VDDQ) U$5.VDDQ@2(VDDQ) U$5.VDDQ@3(VDDQ) U$5.VDDQ@4(VDDQ) U$5.VDDQ@5(VDDQ) U$5.VDDQ@6(VDDQ) U$6.VDD@1(VDD) U$6.VDD@2(VDD) U$6.VDD@3(VDD) U$6.VDD@4(VDD) U$6.VDD@5(VDD) U$6.VDD@6(VDD) U$6.VDD@7(VDD) U$6.VDD@8(VDD) U$6.VDDQ@1(VDDQ) U$6.VDDQ@2(VDDQ) U$6.VDDQ@3(VDDQ) U$6.VDDQ@4(VDDQ) U$6.VDDQ@5(VDDQ) U$6.VDDQ@6(VDDQ) U$7.VDD@1(VDD) U$7.VDD@2(VDD) U$7.VDD@3(VDD) U$7.VDD@4(VDD) U$7.VDD@5(VDD) U$7.VDD@6(VDD) U$7.VDD@7(VDD) U$7.VDD@8(VDD) U$7.VDDQ@1(VDDQ) U$7.VDDQ@2(VDDQ) U$7.VDDQ@3(VDDQ) U$7.VDDQ@4(VDDQ) U$7.VDDQ@5(VDDQ) U$7.VDDQ@6(VDDQ) ; also sheet 3,10
VDDR_VTT: C431.1 C432.1 C433.1 C434.1 C435.1 C436.1 C437.1 C438.1 C439.1 C440.1 C441.1 C442.1 C443.1 C444.1 C445.1 C632.1 C633.1 C634.1 C635.1 R188.2 R189.2 R190.2 R191.2 R192.2 R193.2 R194.2 R195.2 R196.2 R197.2 R198.2 R199.2 R200.2 R209.2 R210.2 R266.2 R267.2 R268.2 R269.2 R270.2 R271.2 R272.2 R273.2 R274.2 R275.2 R276.2 R277.2 R278.2 R279.2 R280.2 ; also sheet 3
VOUT_BOOTMODE0: U1.M27(E:GPMC0_AD0) ; also sheet 11
VOUT_BOOTMODE1: U1.M23(E:GPMC0_AD1) ; also sheet 11
VOUT_BOOTMODE2: U1.M28(E:GPMC0_AD2) ; also sheet 11
VOUT_BOOTMODE3: U1.M24(E:GPMC0_AD3) ; also sheet 11
VOUT_BOOTMODE4: U1.N24(E:GPMC0_AD4) ; also sheet 11
VOUT_BOOTMODE5: U1.N27(E:GPMC0_AD5) ; also sheet 11
VOUT_BOOTMODE6: U1.N28(E:GPMC0_AD6) ; also sheet 11
VOUT_BOOTMODE7: U1.M25(E:GPMC0_AD7) ; also sheet 11
VOUT_BOOTMODE8: U1.N23(E:GPMC0_AD8) ; also sheet 11
VOUT_BOOTMODE9: U1.M26(E:GPMC0_AD9) ; also sheet 11
VOUT_BOOTMODE10: U1.P28(E:GPMC0_AD10) ; also sheet 11
VOUT_BOOTMODE11: U1.P27(E:GPMC0_AD11) ; also sheet 11
VOUT_BOOTMODE12: U1.N26(E:GPMC0_AD12) ; also sheet 11
VOUT_BOOTMODE13: U1.N25(E:GPMC0_AD13) ; also sheet 11
VOUT_BOOTMODE14: U1.P24(E:GPMC0_AD14) ; also sheet 11
VOUT_BOOTMODE15: U1.R27(E:GPMC0_AD15) ; also sheet 11
VOUT_BOOTMODE16: U1.P25(E:GPMC0_ADVN_ALE) ; also sheet 11
VOUT_BOOTMODE17: U1.P26(E:GPMC0_OEN_REN) ; also sheet 11
VOUT_BOOTMODE18: U1.U28(E:GPMC0_WEN) ; also sheet 11
VSS: C341.1 C342.1 C343.1 C344.1 C345.1 C346.1 C347.1 C348.1 C349.1 C350.1 C351.1 C352.1 C353.1 C354.1 C355.1 C356.1 C357.1 C358.1 C359.1 C360.1 C361.1 C362.1 C363.1 C364.1 C365.1 C366.1 C367.1 C368.1 C369.1 C370.1 C371.1 C372.1 C373.1 C374.1 C375.1 C376.1 C377.1 C378.1 C379.1 C380.1 C381.1 C382.1 C383.1 C384.1 C385.1 C386.1 C387.1 C388.1 C389.1 C390.1 C391.1 C392.1 C393.1 C394.1 C395.1 C396.1 C397.1 C398.1 C399.1 C400.1 C401.1 C402.1 C403.1 C404.1 C405.1 C406.1 C407.1 C408.1 C409.1 C410.1 C411.1 C412.1 C413.1 C414.1 C415.1 C416.1 C417.1 C418.1 C419.1 C420.1 C421.1 C422.1 C423.1 C424.1 C425.1 C428.1 C429.1 C431.2 C432.2 C433.2 C434.2 C435.2 C436.2 C437.2 C438.2 C439.2 C440.2 C441.2 C442.2 C443.2 C444.2 C445.2 C610.1 C628.1 C629.1 C630.1 C631.1 C632.2 C633.2 C634.2 C635.2 R144.1 R145.1 R146.1 R147.1 R148.1 R150.2 R180.1 R181.1 R182.1 R185.1 U$3.VSS@1(VSS) U$3.VSS@2(VSS) U$3.VSS@3(VSS) U$3.VSS@4(VSS) U$3.VSS@5(VSS) U$3.VSS@6(VSS) U$3.VSS@7(VSS) U$3.VSS@8(VSS) U$3.VSS@9(VSS) U$3.VSSQ@1(VSSQ) U$3.VSSQ@2(VSSQ) U$3.VSSQ@3(VSSQ) U$3.VSSQ@4(VSSQ) U$4.VSS@1(VSS) U$4.VSS@2(VSS) U$4.VSS@3(VSS) U$4.VSS@4(VSS) U$4.VSS@5(VSS) U$4.VSS@6(VSS) U$4.VSS@7(VSS) U$4.VSS@8(VSS) U$4.VSS@9(VSS) U$4.VSSQ@1(VSSQ) U$4.VSSQ@2(VSSQ) U$4.VSSQ@3(VSSQ) U$4.VSSQ@4(VSSQ) U$5.VSS@1(VSS) U$5.VSS@2(VSS) U$5.VSS@3(VSS) U$5.VSS@4(VSS) U$5.VSS@5(VSS) U$5.VSS@6(VSS) U$5.VSS@7(VSS) U$5.VSS@8(VSS) U$5.VSS@9(VSS) U$5.VSSQ@1(VSSQ) U$5.VSSQ@2(VSSQ) U$5.VSSQ@3(VSSQ) U$5.VSSQ@4(VSSQ) U$6.VSS@1(VSS) U$6.VSS@2(VSS) U$6.VSS@3(VSS) U$6.VSS@4(VSS) U$6.VSS@5(VSS) U$6.VSS@6(VSS) U$6.VSS@7(VSS) U$6.VSS@8(VSS) U$6.VSS@9(VSS) U$6.VSSQ@1(VSSQ) U$6.VSSQ@2(VSSQ) U$6.VSSQ@3(VSSQ) U$6.VSSQ@4(VSSQ) U$7.VSS@1(VSS) U$7.VSS@2(VSS) U$7.VSS@3(VSS) U$7.VSS@4(VSS) U$7.VSS@5(VSS) U$7.VSS@6(VSS) U$7.VSS@7(VSS) U$7.VSS@8(VSS) U$7.VSS@9(VSS) U$7.VSSQ@1(VSSQ) U$7.VSSQ@2(VSSQ) U$7.VSSQ@3(VSSQ) U$7.VSSQ@4(VSSQ) ; also sheet 1,2,3,4,5,6,7,8,9,10,11,13,14,15,16,17,18,19
Unconnected: U1.A7(C:DDR_CK1P) U1.B7(C:DDR_CK1N) U1.C12(C:RSV5) U1.F9(C:RSV6) U1.F10(C:RSV7) U1.F15(C:DDR_VREF_ZQ) U$3.NF/TDQS_C U$4.NF/TDQS_C U$5.NF/TDQS_C U$6.NF/TDQS_C U$7.NF/TDQS_C

## Sheet 13 of 19: eMMC + SDMMC
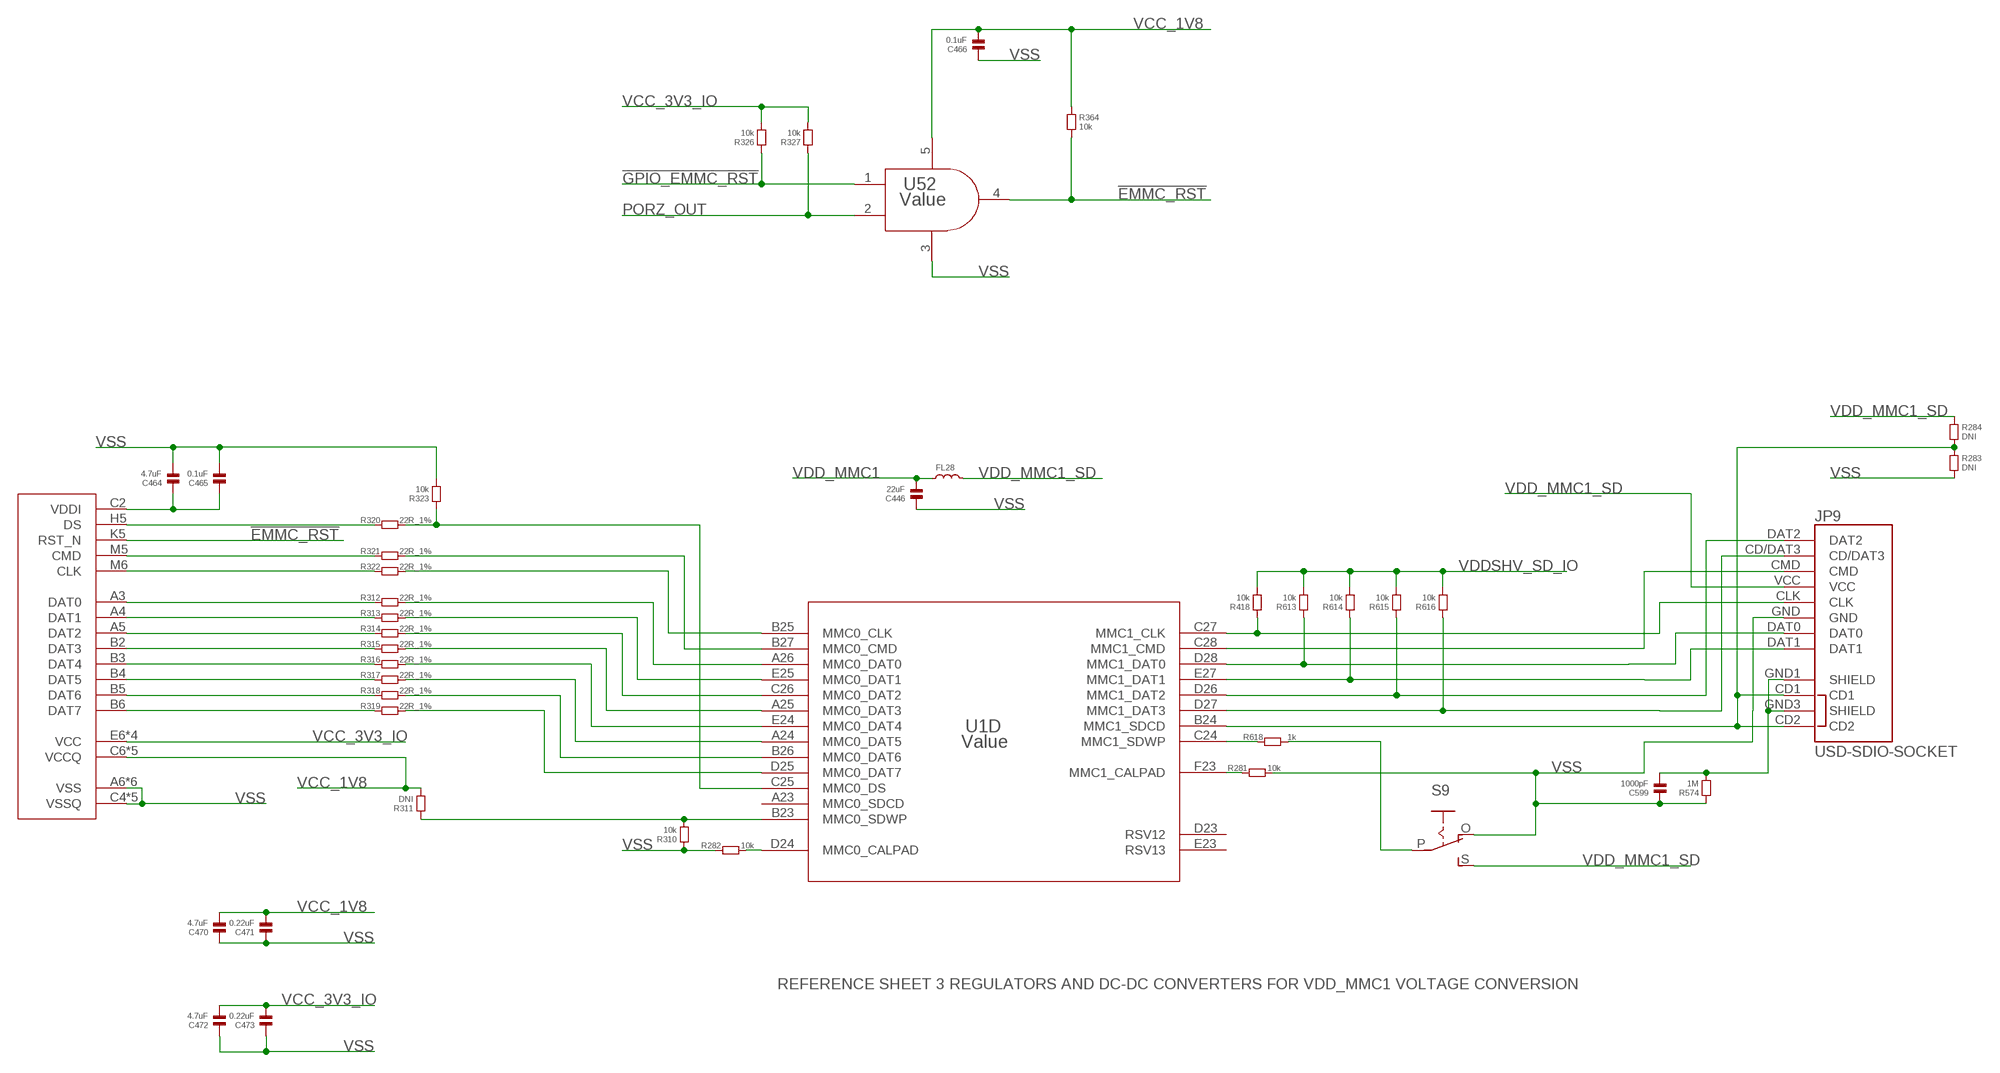
[diagram p26: schematic, sheet 13]

### Parts
C446  22uF  CAPACITOR.0603  [0603]
C464  4.7uF  CAPACITOR.0603  [0603]
C465  0.1uF  CAPACITOR.0603  [0603]
C466  0.1uF  CAPACITOR.0603  [0603]
C470  4.7uF  CAPACITOR.0603  [0603]
C471  0.22uF  CAPACITOR.0603  [0603]
C472  4.7uF  CAPACITOR.0603  [0603]
C473  0.22uF  CAPACITOR.0603  [0603]
C599  1000pF  CAPACITOR.0603  [0603]
FL28  RF-INDUCTOR.0603  [0603]
JP9  USD-SDIO-SOCKET  [MICRO-SD-SOCKET-SDIO]
R281  10k  RESISTOR.0402  [0402]
R282  10k  RESISTOR.0603  [0603]
R283  DNI  RESISTOR.0603  [0603]
R284  DNI  RESISTOR.0603  [0603]
R310  10k  RESISTOR.0603  [0603]
R311  DNI  RESISTOR.0603  [0603]
R312  22R_1%  RESISTOR.0402  [0402]
R313  22R_1%  RESISTOR.0402  [0402]
R314  22R_1%  RESISTOR.0402  [0402]
R315  22R_1%  RESISTOR.0402  [0402]
R316  22R_1%  RESISTOR.0402  [0402]
R317  22R_1%  RESISTOR.0402  [0402]
R318  22R_1%  RESISTOR.0402  [0402]
R319  22R_1%  RESISTOR.0402  [0402]
R320  22R_1%  RESISTOR.0402  [0402]
R321  22R_1%  RESISTOR.0402  [0402]
R322  22R_1%  RESISTOR.0402  [0402]
R323  10k  RESISTOR.0402  [0402]
R326  10k  RESISTOR.0603  [0603]
R327  10k  RESISTOR.0603  [0603]
R364  10k  RESISTOR.0603  [0603]
R418  10k  RESISTOR.0603  [0603]
R574  1M  RESISTOR.0603  [0603]
R613  10k  RESISTOR.0603  [0603]
R614  10k  RESISTOR.0603  [0603]
R615  10k  RESISTOR.0603  [0603]
R616  10k  RESISTOR.0603  [0603]
R618  1k  RESISTOR.0603  [0603]
S9  EG1218S  [EG1218]
U52  Value  SN74LVC1G08DBVR  [DBV0005A_N]
U$10  IS21ES16G  [BGA153C50P14X14_1150X1300X100N]

### Nets
!EMMC_RST: R364.2 U52.4(Y) U$10.K5(RST_N)
!GPIO_EMMC_RST: R326.1 U52.1(A) ; also sheet 17
N$70: JP9.CLK R418.1 U1.C27(D:MMC1_CLK)
N$146: JP9.CD/DAT3 R616.1 U1.D27(D:MMC1_DAT3)
N$147: JP9.DAT2 R615.1 U1.D26(D:MMC1_DAT2)
N$148: JP9.DAT1 R614.1 U1.E27(D:MMC1_DAT1)
N$149: JP9.DAT0 R613.1 U1.D28(D:MMC1_DAT0)
N$150: JP9.CMD U1.C28(D:MMC1_CMD)
N$151: JP9.CD1 JP9.CD2 R283.1 R284.2 U1.B24(D:MMC1_SDCD)
N$152: R618.2 S9.P
N$153: R282.2 U1.D24(D:MMC0_CALPAD)
N$154: R281.1 U1.F23(D:MMC1_CALPAD)
N$167: R618.1 U1.C24(D:MMC1_SDWP)
N$211: C599.2 JP9.GND1(SHIELD) JP9.GND3(SHIELD) R574.2
N$226: R310.2 R311.1 U1.B23(D:MMC0_SDWP)
N$227: C464.1 C465.1 U$10.C2(VDDI)
N$228: R320.2 R323.1 U1.C25(D:MMC0_DS)
N$229: R321.2 U1.B27(D:MMC0_CMD)
N$230: R322.2 U1.B25(D:MMC0_CLK)
N$231: R312.2 U1.A26(D:MMC0_DAT0)
N$232: R313.2 U1.E25(D:MMC0_DAT1)
N$233: R314.2 U1.C26(D:MMC0_DAT2)
N$234: R315.2 U1.A25(D:MMC0_DAT3)
N$235: R316.2 U1.E24(D:MMC0_DAT4)
N$236: R317.2 U1.A24(D:MMC0_DAT5)
N$237: R318.2 U1.B26(D:MMC0_DAT6)
N$238: R319.2 U1.D25(D:MMC0_DAT7)
N$239: R312.1 U$10.A3(DAT0)
N$240: R313.1 U$10.A4(DAT1)
N$241: R314.1 U$10.A5(DAT2)
N$242: R315.1 U$10.B2(DAT3)
N$243: R316.1 U$10.B3(DAT4)
N$244: R317.1 U$10.B4(DAT5)
N$245: R318.1 U$10.B5(DAT6)
N$246: R319.1 U$10.B6(DAT7)
N$247: R320.1 U$10.H5(DS)
N$248: R321.1 U$10.M5(CMD)
N$249: R322.1 U$10.M6(CLK)
PORZ_OUT: R327.1 U52.2(B) ; also sheet 1,6,11,16,17,18,19
VCC_1V8: C466.2 C470.2 C471.2 R311.2 R364.1 U52.5(V+) U$10.C6(VCCQ) U$10.M4(VCCQ) U$10.N4(VCCQ) U$10.P3(VCCQ) U$10.P5(VCCQ) ; also sheet 1,3,6,7,8,10,14,15,18,19
VCC_3V3_IO: C472.2 C473.2 R326.2 R327.2 U$10.E6(VCC) U$10.F5(VCC) U$10.J10(VCC) U$10.K9(VCC) ; also sheet 1,3,5,6,7,8,9,10,11,14,15,16,17,19
VDD_MMC1: C446.2 FL28.1 ; also sheet 3
VDD_MMC1_SD: FL28.2 JP9.VCC R284.1 S9.S
VDDSHV_SD_IO: R418.2 R613.2 R614.2 R615.2 R616.2 ; also sheet 2
VSS: C446.1 C464.2 C465.2 C466.1 C470.1 C471.1 C472.1 C473.1 C599.1 JP9.GND R281.2 R282.1 R283.2 R310.1 R323.2 R574.1 S9.O U52.3(V-) U$10.A6(VSS) U$10.C4(VSSQ) U$10.E7(VSS) U$10.G5(VSS) U$10.H10(VSS) U$10.J5(VSS) U$10.K8(VSS) U$10.N2(VSSQ) U$10.N5(VSSQ) U$10.P4(VSSQ) U$10.P6(VSSQ) ; also sheet 1,2,3,4,5,6,7,8,9,10,11,12,14,15,16,17,18,19
Unconnected: U1.A23(D:MMC0_SDCD) U1.D23(D:RSV12) U1.E23(D:RSV13)

### Notes on the sheet
- REFERENCE SHEET 3 REGULATORS AND DC-DC CONVERTERS FOR VDD_MMC1 VOLTAGE CONVERSION

## Sheet 14 of 19: Clocks
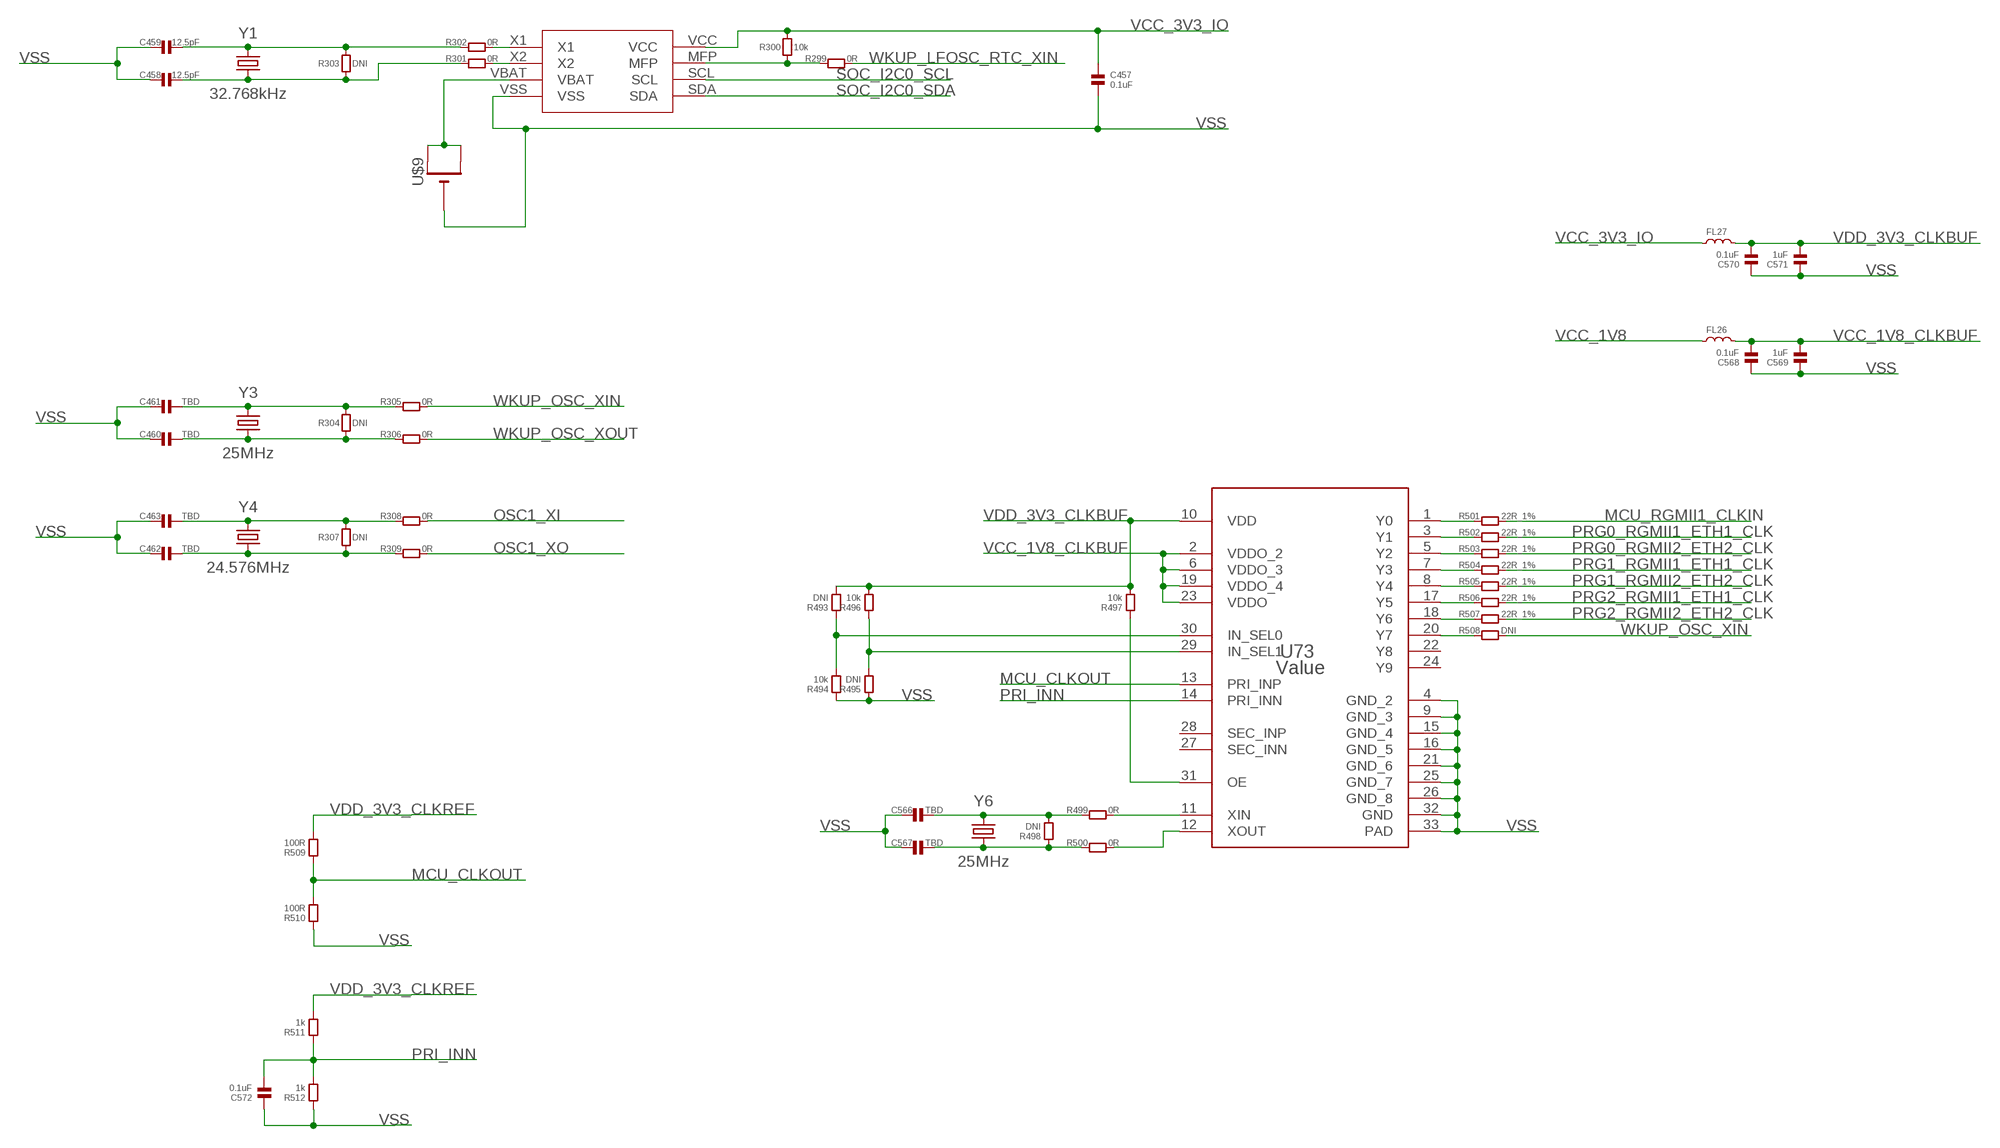
[diagram p27: schematic, sheet 14]

### Parts
C457  0.1uF  CAPACITOR.0603  [0603]
C458  12.5pF  CAPACITOR.0402  [0402]
C459  12.5pF  CAPACITOR.0402  [0402]
C460  TBD  CAPACITOR.0402  [0402]
C461  TBD  CAPACITOR.0402  [0402]
C462  TBD  CAPACITOR.0402  [0402]
C463  TBD  CAPACITOR.0402  [0402]
C566  TBD  CAPACITOR.0402  [0402]
C567  TBD  CAPACITOR.0402  [0402]
C568  0.1uF  CAPACITOR.0603  [0603]
C569  1uF  CAPACITOR.0603  [0603]
C570  0.1uF  CAPACITOR.0603  [0603]
C571  1uF  CAPACITOR.0603  [0603]
C572  0.1uF  CAPACITOR.0402  [0402]
FL26  RF-INDUCTOR.0603  [0603]
FL27  RF-INDUCTOR.0603  [0603]
P1  SOIC127P600X175-8N  [SOIC127P600X175-8N]
R299  0R  RESISTOR.0402  [0402]
R300  10k  RESISTOR.0402  [0402]
R301  0R  RESISTOR.0402  [0402]
R302  0R  RESISTOR.0402  [0402]
R303  DNI  RESISTOR.0402  [0402]
R304  DNI  RESISTOR.0402  [0402]
R305  0R  RESISTOR.0402  [0402]
R306  0R  RESISTOR.0402  [0402]
R307  DNI  RESISTOR.0402  [0402]
R308  0R  RESISTOR.0402  [0402]
R309  0R  RESISTOR.0402  [0402]
R493  DNI  RESISTOR.0402  [0402]
R494  10k  RESISTOR.0402  [0402]
R495  DNI  RESISTOR.0402  [0402]
R496  10k  RESISTOR.0402  [0402]
R497  10k  RESISTOR.0603  [0603]
R498  DNI  RESISTOR.0402  [0402]
R499  0R  RESISTOR.0402  [0402]
R500  0R  RESISTOR.0402  [0402]
R501  22R_1%  RESISTOR.0402  [0402]
R502  22R_1%  RESISTOR.0402  [0402]
R503  22R_1%  RESISTOR.0402  [0402]
R504  22R_1%  RESISTOR.0402  [0402]
R505  22R_1%  RESISTOR.0402  [0402]
R506  22R_1%  RESISTOR.0402  [0402]
R507  22R_1%  RESISTOR.0402  [0402]
R508  DNI  RESISTOR.0402  [0402]
R509  100R  RESISTOR.0402  [0402]
R510  100R  RESISTOR.0402  [0402]
R511  1k  RESISTOR.0402  [0402]
R512  1k  RESISTOR.0402  [0402]
U73  Value  CDCLVC1310RHBR  [RHB0032D]
U$9  CR1220THM  [CR1220-THM]
Y1  32.768kHz  CRYSTAL-32.768KHZPTH-2X6  [CRYSTAL-PTH-2X6-CYL]
Y3  25MHz  CRYSTALSMD-3.2X2.5  [CRYSTAL-SMD-3.2X2.5MM]
Y4  24.576MHz  CRYSTALSMD-3.2X2.5  [CRYSTAL-SMD-3.2X2.5MM]
Y6  25MHz  CRYSTALSMD-3.2X2.5  [CRYSTAL-SMD-3.2X2.5MM]

### Nets
MCU_CLKOUT: R509.1 R510.2 U73.13(PRI_INP) ; also sheet 1
MCU_RGMII1_CLKIN: R501.2 ; also sheet 6
N$158: P1.MFP R299.1 R300.1
N$160: P1.X2 R301.2
N$161: P1.X1 R302.2
N$219: C461.2 R304.2 R305.1 Y3.3
N$220: P1.VBAT U$9.+1(+) U$9.+2(+1)
N$221: C459.2 R302.1 R303.2 Y1.2
N$222: C458.2 R301.1 R303.1 Y1.1
N$223: C460.2 R304.1 R306.1 Y3.1
N$224: C463.2 R307.2 R308.1 Y4.3
N$225: C462.2 R307.1 R309.1 Y4.1
N$320: R493.1 R494.2 U73.30(IN_SEL0)
N$321: R495.2 R496.1 U73.29(IN_SEL1)
N$322: R497.1 U73.31(OE)
N$323: C566.2 R498.2 R499.1 Y6.1
N$324: R499.2 U73.11(XIN)
N$325: R500.2 U73.12(XOUT)
N$326: C567.2 R498.1 R500.1 Y6.3
N$327: R501.1 U73.1(Y0)
N$329: R502.1 U73.3(Y1)
N$331: R503.1 U73.5(Y2)
N$333: R504.1 U73.7(Y3)
N$335: R505.1 U73.8(Y4)
N$337: R506.1 U73.17(Y5)
N$339: R507.1 U73.18(Y6)
N$341: R508.1 U73.20(Y7)
OSC1_XI: R308.2 ; also sheet 1
OSC1_XO: R309.2 ; also sheet 1
PRG0_RGMII1_ETH1_CLK: R502.2
PRG0_RGMII2_ETH2_CLK: R503.2
PRG1_RGMII1_ETH1_CLK: R504.2
PRG1_RGMII2_ETH2_CLK: R505.2
PRG2_RGMII1_ETH1_CLK: R506.2 ; also sheet 6
PRG2_RGMII2_ETH2_CLK: R507.2 ; also sheet 6
PRI_INN: C572.2 R511.1 R512.2 U73.14(PRI_INN)
SOC_I2C0_SCL: P1.SCL ; also sheet 1,19
SOC_I2C0_SDA: P1.SDA ; also sheet 1,19
VCC_1V8: FL26.1 ; also sheet 1,3,6,7,8,10,13,15,18,19
VCC_1V8_CLKBUF: C568.2 C569.2 FL26.2 U73.2(VDDO_2) U73.6(VDDO_3) U73.19(VDDO_4) U73.23(VDDO)
VCC_3V3_IO: C457.1 FL27.1 P1.VCC R300.2 ; also sheet 1,3,5,6,7,8,9,10,11,13,15,16,17,19
VDD_3V3_CLKBUF: C570.2 C571.2 FL27.2 R493.2 R496.2 R497.2 U73.10(VDD)
VDD_3V3_CLKREF: R509.2 R511.2
VSS: C457.2 C458.1 C459.1 C460.1 C461.1 C462.1 C463.1 C566.1 C567.1 C568.1 C569.1 C570.1 C571.1 C572.1 P1.VSS R494.1 R495.1 R510.1 R512.1 U73.4(GND_2) U73.9(GND_3) U73.15(GND_4) U73.16(GND_5) U73.21(GND_6) U73.25(GND_7) U73.26(GND_8) U73.32(GND) U73.33(PAD) U$9.- ; also sheet 1,2,3,4,5,6,7,8,9,10,11,12,13,15,16,17,18,19
WKUP_LFOSC_RTC_XIN: R299.2 ; also sheet 1
WKUP_OSC_XIN: R305.2 R508.2 ; also sheet 1
WKUP_OSC_XOUT: R306.2 ; also sheet 1
Unconnected: U73.22(Y8) U73.24(Y9) U73.27(SEC_INN) U73.28(SEC_INP)

## Sheet 15 of 19: Board Utilities
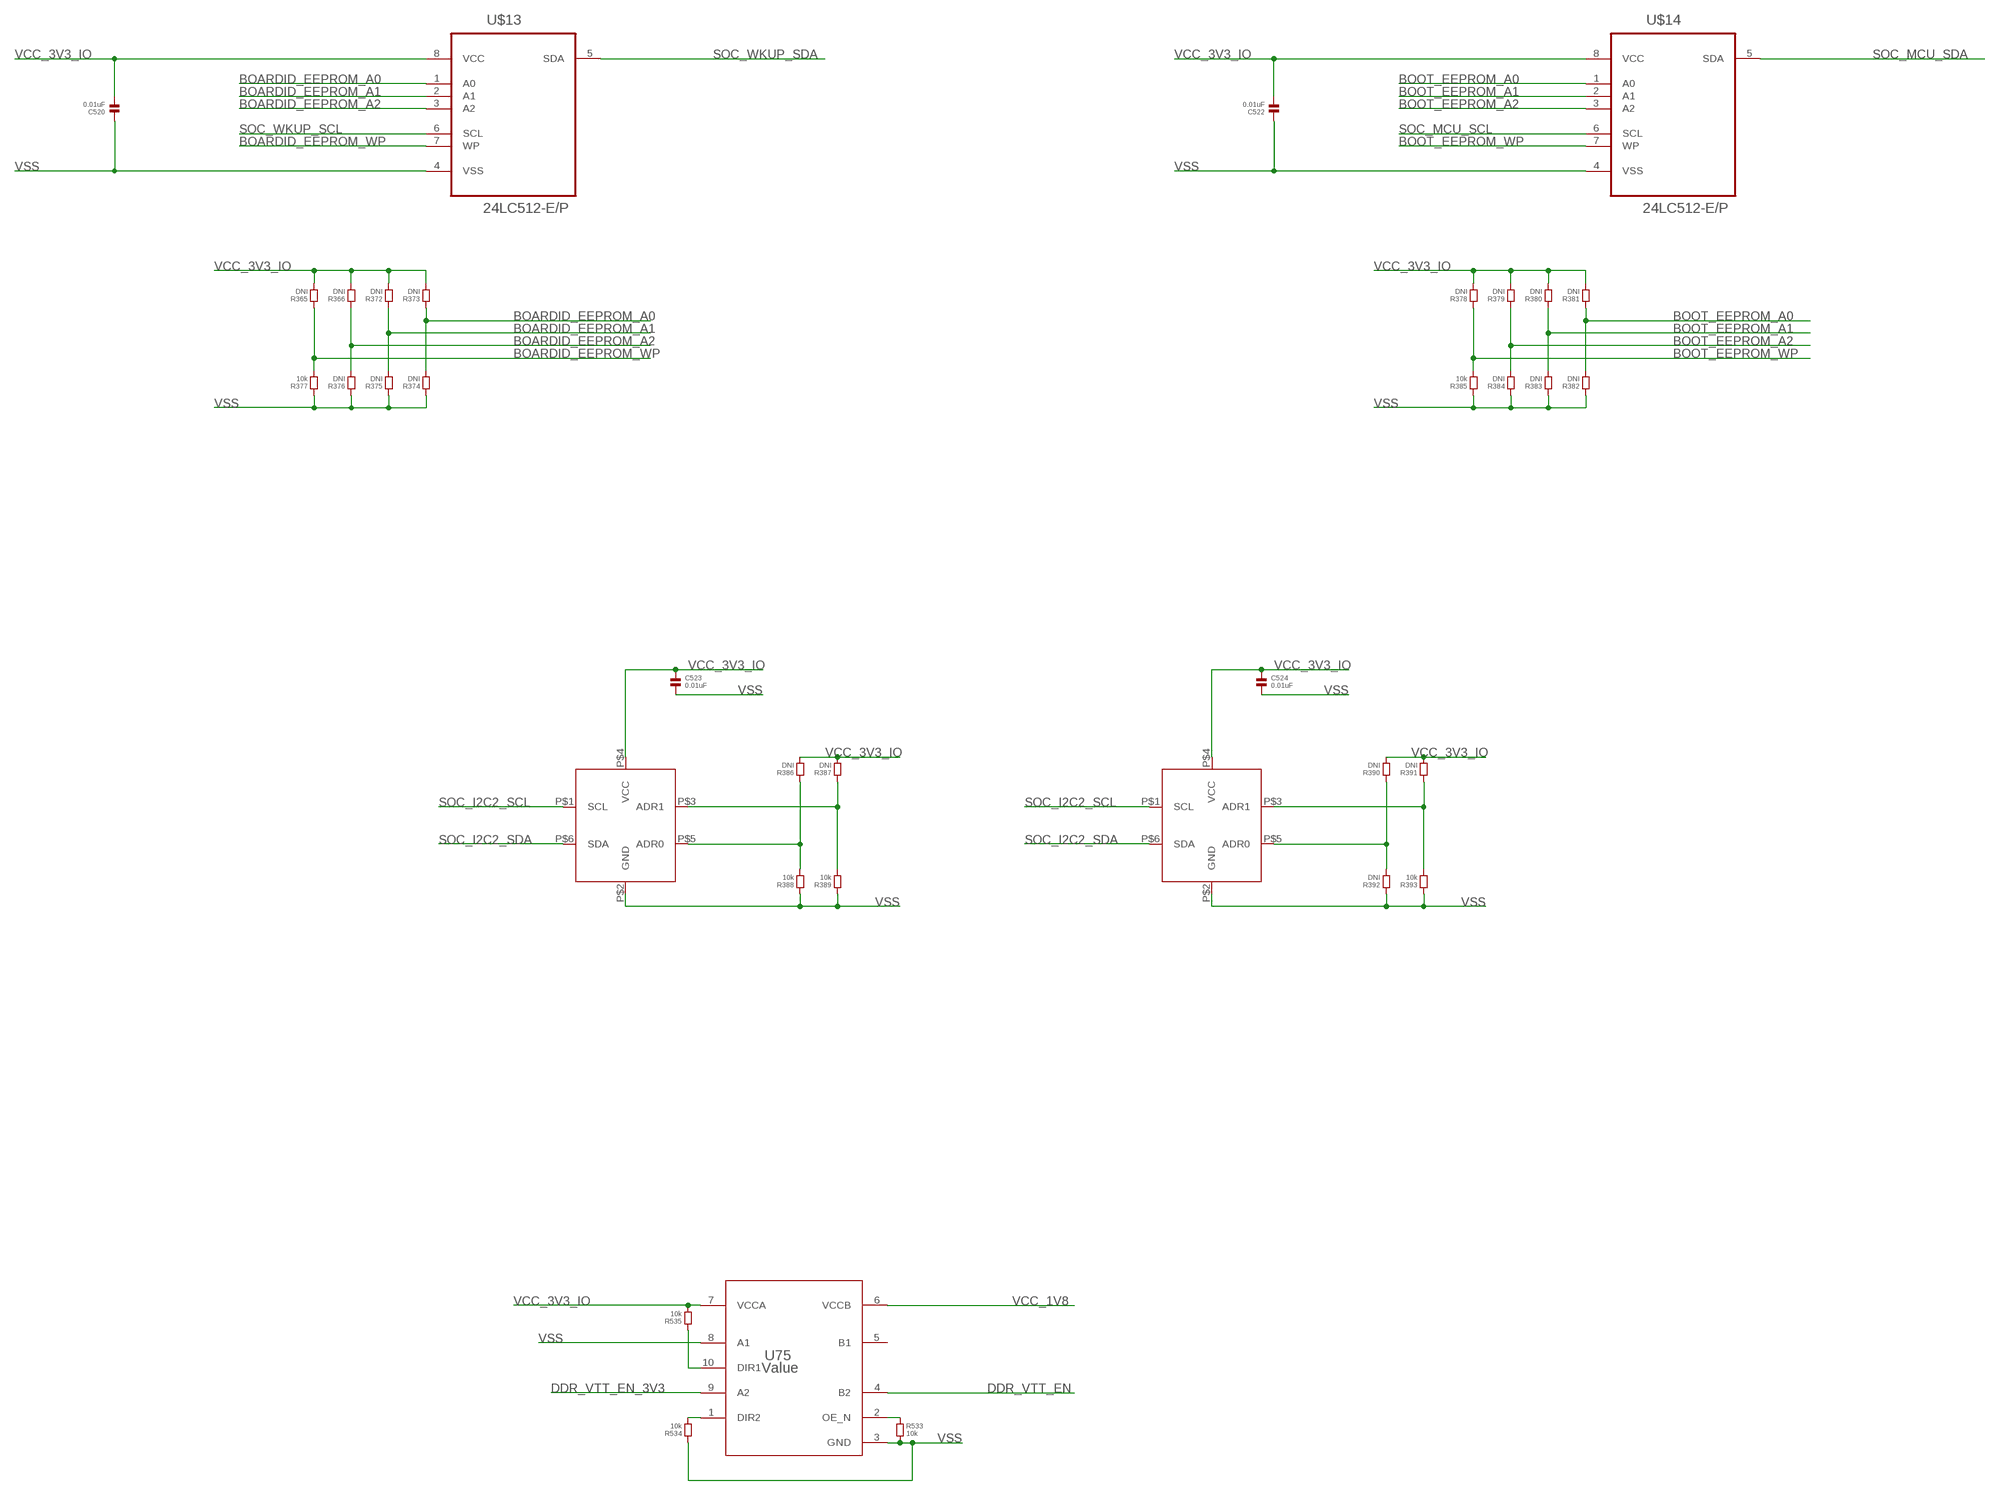
[diagram p28: schematic, sheet 15]

### Parts
C520  0.01uF  CAPACITOR.0603  [0603]
C522  0.01uF  CAPACITOR.0603  [0603]
C523  0.01uF  CAPACITOR.0402  [0402]
C524  0.01uF  CAPACITOR.0402  [0402]
R365  DNI  RESISTOR.0603  [0603]
R366  DNI  RESISTOR.0603  [0603]
R372  DNI  RESISTOR.0603  [0603]
R373  DNI  RESISTOR.0603  [0603]
R374  DNI  RESISTOR.0603  [0603]
R375  DNI  RESISTOR.0603  [0603]
R376  DNI  RESISTOR.0603  [0603]
R377  10k  RESISTOR.0603  [0603]
R378  DNI  RESISTOR.0603  [0603]
R379  DNI  RESISTOR.0603  [0603]
R380  DNI  RESISTOR.0603  [0603]
R381  DNI  RESISTOR.0603  [0603]
R382  DNI  RESISTOR.0603  [0603]
R383  DNI  RESISTOR.0603  [0603]
R384  DNI  RESISTOR.0603  [0603]
R385  10k  RESISTOR.0603  [0603]
R386  DNI  RESISTOR.0402  [0402]
R387  DNI  RESISTOR.0402  [0402]
R388  10k  RESISTOR.0402  [0402]
R389  10k  RESISTOR.0402  [0402]
R390  DNI  RESISTOR.0402  [0402]
R391  DNI  RESISTOR.0402  [0402]
R392  DNI  RESISTOR.0402  [0402]
R393  10k  RESISTOR.0402  [0402]
R533  10k  RESISTOR.0603  [0603]
R534  10k  RESISTOR.0603  [0603]
R535  10k  RESISTOR.0603  [0603]
U75  Value  SN74AVC2T245RSWR  [RSW0010A]
U$13  24LC512-E/P  [DIP254P762X432-8]
U$14  24LC512-E/P  [DIP254P762X432-8]
U$15  TMP100  [SOT23-6]
U$16  TMP100  [SOT23-6]

### Nets
BOARDID_EEPROM_A0: R373.1 R374.2 U$13.1(A0)
BOARDID_EEPROM_A1: R372.1 R375.2 U$13.2(A1)
BOARDID_EEPROM_A2: R366.1 R376.2 U$13.3(A2)
BOARDID_EEPROM_WP: R365.1 R377.2 U$13.7(WP)
BOOT_EEPROM_A0: R381.1 R382.2 U$14.1(A0)
BOOT_EEPROM_A1: R380.1 R383.2 U$14.2(A1)
BOOT_EEPROM_A2: R379.1 R384.2 U$14.3(A2)
BOOT_EEPROM_WP: R378.1 R385.2 U$14.7(WP)
DDR_VTT_EN: U75.4(B2) ; also sheet 1
DDR_VTT_EN_3V3: U75.9(A2) ; also sheet 3
N$287: R386.1 R388.2 U$15.P$5(ADR0)
N$288: R387.1 R389.2 U$15.P$3(ADR1)
N$289: R390.1 R392.2 U$16.P$5(ADR0)
N$290: R391.1 R393.2 U$16.P$3(ADR1)
N$365: R533.1 U75.2(OE_N)
N$366: R534.2 U75.1(DIR2)
N$368: R535.1 U75.10(DIR1)
SOC_I2C2_SCL: U$15.P$1(SCL) U$16.P$1(SCL) ; also sheet 8,10,12,19
SOC_I2C2_SDA: U$15.P$6(SDA) U$16.P$6(SDA) ; also sheet 8,10,12,19
SOC_MCU_SCL: U$14.6(SCL) ; also sheet 1,19
SOC_MCU_SDA: U$14.5(SDA) ; also sheet 1,19
SOC_WKUP_SCL: U$13.6(SCL) ; also sheet 1,3,16,17,19
SOC_WKUP_SDA: U$13.5(SDA) ; also sheet 1,3,16,17,19
VCC_1V8: U75.6(VCCB) ; also sheet 1,3,6,7,8,10,13,14,18,19
VCC_3V3_IO: C520.2 C522.2 C523.1 C524.1 R365.2 R366.2 R372.2 R373.2 R378.2 R379.2 R380.2 R381.2 R386.2 R387.2 R390.2 R391.2 R535.2 U75.7(VCCA) U$13.8(VCC) U$14.8(VCC) U$15.P$4(VCC) U$16.P$4(VCC) ; also sheet 1,3,5,6,7,8,9,10,11,13,14,16,17,19
VSS: C520.1 C522.1 C523.2 C524.2 R374.1 R375.1 R376.1 R377.1 R382.1 R383.1 R384.1 R385.1 R388.1 R389.1 R392.1 R393.1 R533.2 R534.1 U75.3(GND) U75.8(A1) U$13.4(VSS) U$14.4(VSS) U$15.P$2(GND) U$16.P$2(GND) ; also sheet 1,2,3,4,5,6,7,8,9,10,11,12,13,14,16,17,18,19
Unconnected: U75.5(B1)

## Sheet 16 of 19: OLDI
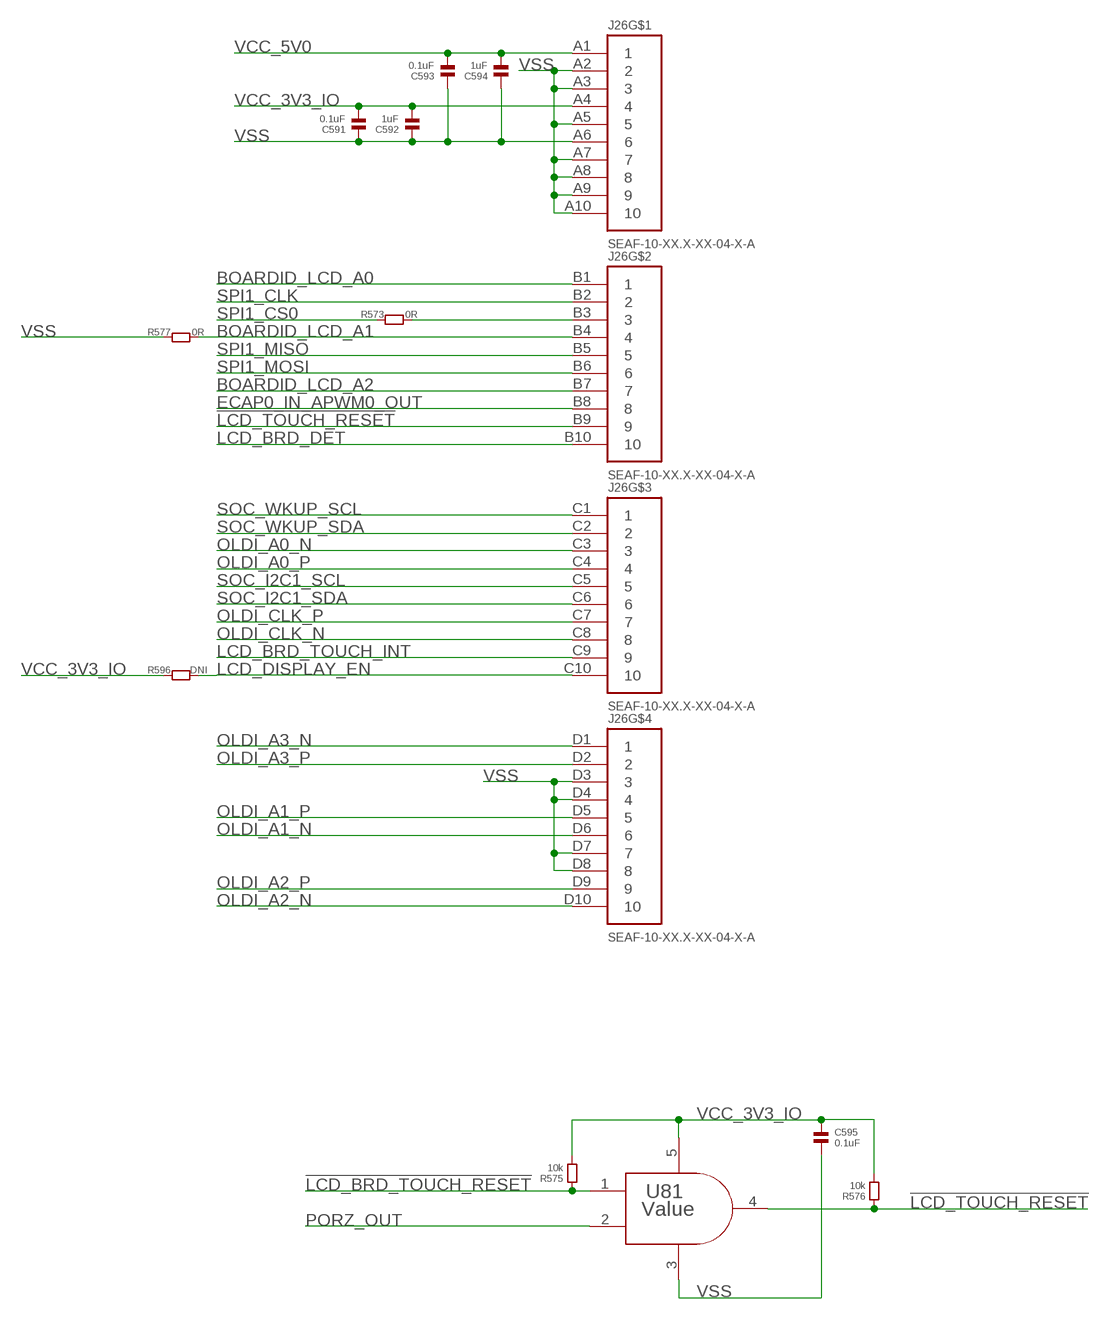
[diagram p29: schematic, sheet 16]

### Parts
C591  0.1uF  CAPACITOR.0603  [0603]
C592  1uF  CAPACITOR.0603  [0603]
C593  0.1uF  CAPACITOR.0603  [0603]
C594  1uF  CAPACITOR.0603  [0603]
C595  0.1uF  CAPACITOR.0603  [0603]
J26  SEAF-10-XX.X-XX-04-X-A  [SEAF-10-XX.X-XX-04-X-A]
R573  0R  RESISTOR.0402  [0402]
R575  10k  RESISTOR.0603  [0603]
R576  10k  RESISTOR.0603  [0603]
R577  0R  RESISTOR.0402  [0402]
R596  DNI  RESISTOR.0402  [0402]
U81  Value  SN74LVC1G08DBVR  [DBV0005A_N]

### Nets
!LCD_BRD_TOUCH_RESET: R575.1 U81.1(A) ; also sheet 17
!LCD_TOUCH_RESET: J26.B9 R576.1 U81.4(Y)
BOARDID_LCD_A0: J26.B1
BOARDID_LCD_A1: J26.B4 R577.1
BOARDID_LCD_A2: J26.B7
ECAP0_IN_APWM0_OUT: J26.B8 ; also sheet 1
LCD_BRD_DET: J26.B10 ; also sheet 17
LCD_BRD_TOUCH_INT: J26.C9 ; also sheet 17
LCD_DISPLAY_EN: J26.C10 R596.2 ; also sheet 17
N$367: J26.B3 R573.2
OLDI_A0_N: J26.C3 ; also sheet 1
OLDI_A0_P: J26.C4 ; also sheet 1
OLDI_A1_N: J26.D6 ; also sheet 1
OLDI_A1_P: J26.D5 ; also sheet 1
OLDI_A2_N: J26.D10 ; also sheet 1
OLDI_A2_P: J26.D9 ; also sheet 1
OLDI_A3_N: J26.D1 ; also sheet 1
OLDI_A3_P: J26.D2 ; also sheet 1
OLDI_CLK_N: J26.C8 ; also sheet 1
OLDI_CLK_P: J26.C7 ; also sheet 1
PORZ_OUT: U81.2(B) ; also sheet 1,6,11,13,17,18,19
SOC_I2C1_SCL: J26.C5 ; also sheet 1,19
SOC_I2C1_SDA: J26.C6 ; also sheet 1,19
SOC_WKUP_SCL: J26.C1 ; also sheet 1,3,15,17,19
SOC_WKUP_SDA: J26.C2 ; also sheet 1,3,15,17,19
SPI1_CLK: J26.B2 ; also sheet 1,19
SPI1_CS0: R573.1 ; also sheet 1,19
SPI1_MISO: J26.B5 ; also sheet 1,19
SPI1_MOSI: J26.B6 ; also sheet 1,19
VCC_3V3_IO: C591.2 C592.2 C595.1 J26.A4 R575.2 R576.2 R596.1 U81.5(V+) ; also sheet 1,3,5,6,7,8,9,10,11,13,14,15,17,19
VCC_5V0: C593.2 C594.2 J26.A1 ; also sheet 3,7,8,9,19
VSS: C591.1 C592.1 C593.1 C594.1 C595.2 J26.A2 J26.A3 J26.A5 J26.A6 J26.A7 J26.A8 J26.A9 J26.A10 J26.D3 J26.D4 J26.D7 J26.D8 R577.2 U81.3(V-) ; also sheet 1,2,3,4,5,6,7,8,9,10,11,12,13,14,15,17,18,19